# Altium project Logicboard_Rev1.PrjPcb (part 1 of 2)
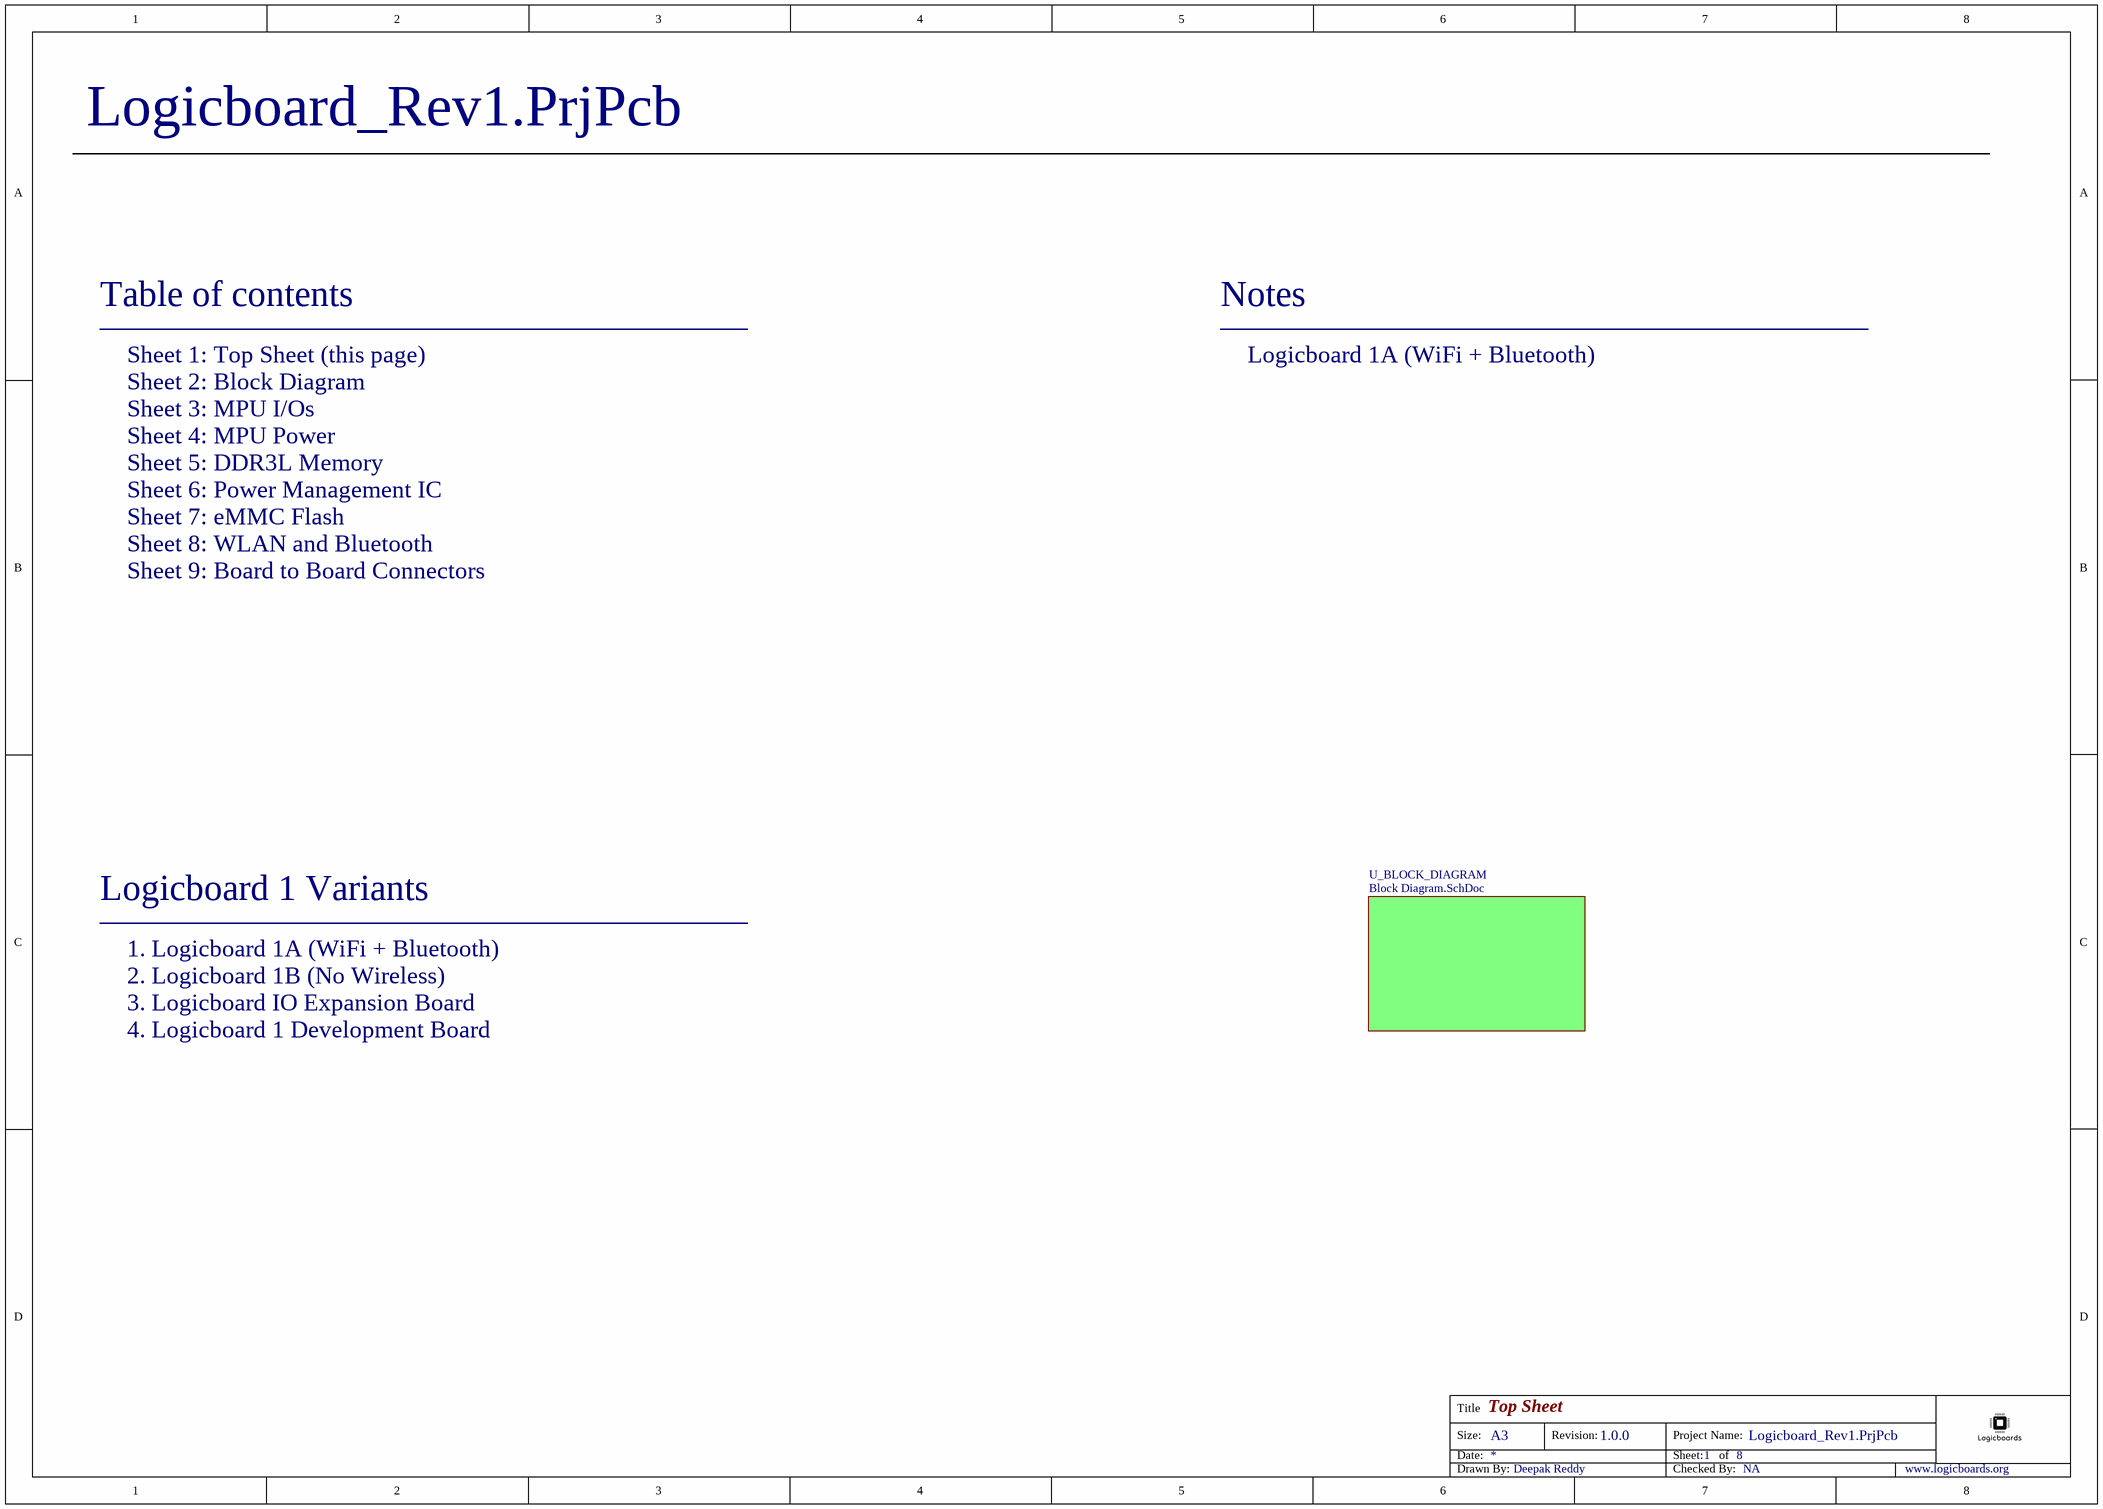
[diagram p0: Top Sheet.SchDoc]
9 sheets, 183 parts. Net scope: flat (ports and power ports of the same name join across sheets).
Board file: Logicboard PCB.PcbDoc
Sheets:
  Top Sheet.SchDoc
    U_BLOCK_DIAGRAM = Block Diagram.SchDoc
      U_MPU_POWER = MPU Power.SchDoc
      U_MPU_18X18 = MPU IOs.SchDoc
      U_DDR3L_MEMORY = DDR3L Memory.SchDoc
      U_POWER_MANAGEMENT_IC = Power Management IC.SchDoc
      U_eMMC_FLASH = eMMC FLASH.SchDoc
      U_WLAN_BLUETOOTH = WLAN and Bluetooth.SchDoc
      U_BOARD_TO_BOARD_CONNECTORS = Board to Board Connectors.SchDoc

## Sheet Top Sheet.SchDoc: Top Sheet
size A3; Date: 09-Sep-2021; CheckedBy: NA; Author: Deepak Reddy; CompanyName: www.logicboards.org; DrawnBy: Deepak Reddy; Revision: 1.0.0; SheetNumber: 1; SheetTotal: 8

### Sub-sheets
U_BLOCK_DIAGRAM = Block Diagram.SchDoc: no entries

### Notes on the sheet
- Table of contents
- Notes
- Sheet 1: Top Sheet (this page)
- Logicboard 1A (WiFi + Bluetooth)
- Sheet 2: Block Diagram
- Sheet 3: MPU I/Os
- Sheet 4: MPU Power
- Sheet 6: Power Management IC
- Sheet 5: DDR3L Memory
- Sheet 8: WLAN and Bluetooth
- Sheet 7: eMMC Flash
- Sheet 9: Board to Board Connectors
- Logicboard 1 Variants
- 1. Logicboard 1A (WiFi + Bluetooth)
- 2. Logicboard 1B (No Wireless)
- 3. Logicboard IO Expansion Board
- 4. Logicboard 1 Development Board
- Title
- Size:
- Date:
- A3
- Revision:
- Project Name:
- Sheet:
- of
- Drawn By:
- Checked By:
- www.logicboards.org

## Sheet Block Diagram.SchDoc: Block Diagram
size A3; CheckedBy: NA; DrawnBy: Deepak Reddy; Revision: 1.0.0; SheetNumber: 2; SheetTotal: 8
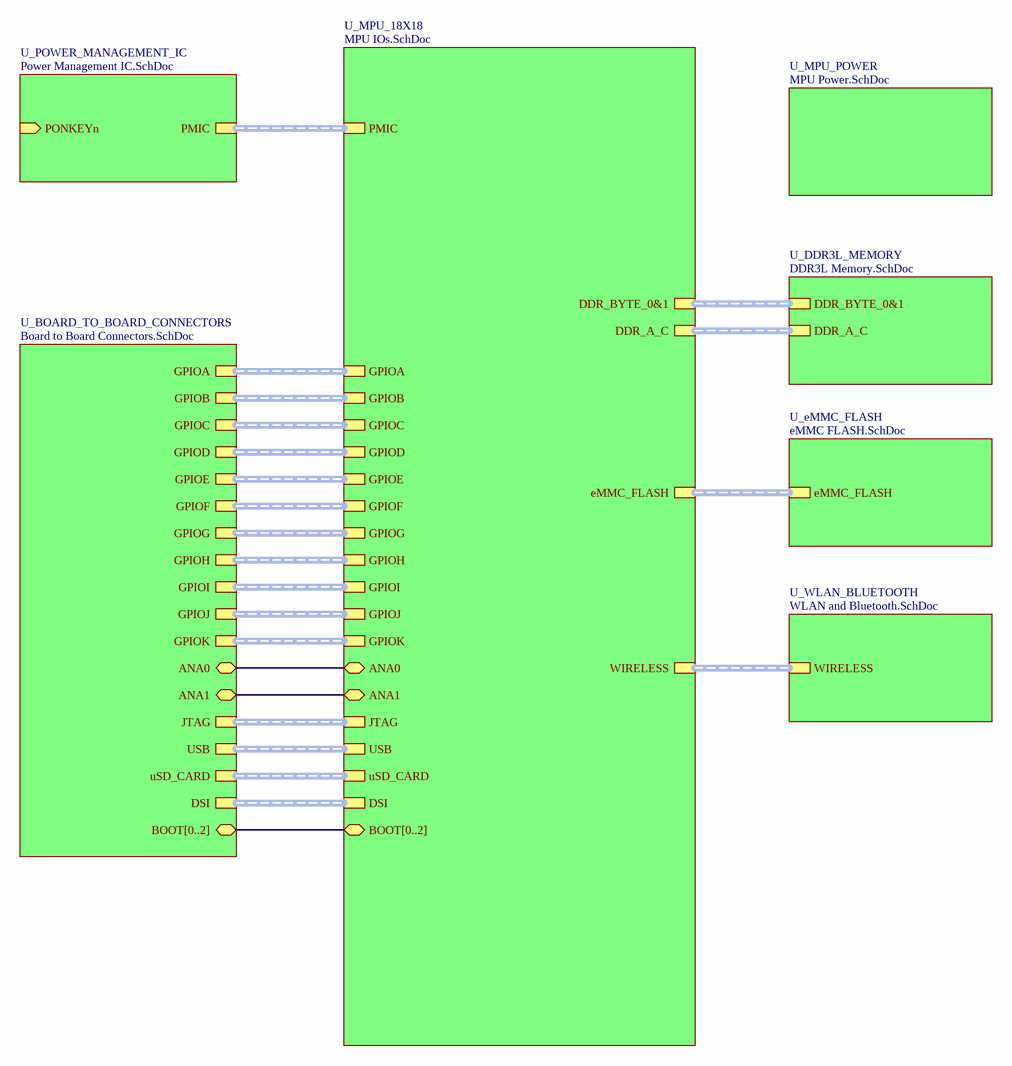
[diagram p1: Block Diagram.SchDoc]

### Sub-sheets
U_BOARD_TO_BOARD_CONNECTORS = Board to Board Connectors.SchDoc: GPIOA (harness GPIOA), GPIOC (harness GPIOC), GPIOB (harness GPIOB), GPIOD (harness GPIOD), ANA1 (bidir), GPIOF (harness GPIOF), GPIOI (harness GPIOI), JTAG (harness JTAG), USB (harness USB), DSI (harness DSI), GPIOK (harness GPIOK), GPIOG (harness GPIOG), GPIOH (harness GPIOH), BOOT[0..2] (bidir), ANA0 (bidir), GPIOE (harness GPIOE), uSD_CARD (harness uSD_CARD), GPIOJ (harness GPIOJ)
U_DDR3L_MEMORY = DDR3L Memory.SchDoc: DDR_BYTE_0&1 (harness DDR_BYTE_0&1), DDR_A_C (harness DDR_A_C)
U_eMMC_FLASH = eMMC FLASH.SchDoc: eMMC_FLASH (harness eMMC_FLASH)
U_MPU_18X18 = MPU IOs.SchDoc: GPIOD (harness GPIOD), ANA1 (bidir), GPIOF (harness GPIOF), DDR_BYTE_0&1 (harness DDR_BYTE_0&1), GPIOA (harness GPIOA), PMIC (harness PMIC), DDR_A_C (harness DDR_A_C), GPIOI (harness GPIOI), JTAG (harness JTAG), USB (harness USB), DSI (harness DSI), GPIOK (harness GPIOK), GPIOG (harness GPIOG), GPIOC (harness GPIOC), GPIOH (harness GPIOH), BOOT[0..2] (bidir), ANA0 (bidir), GPIOE (harness GPIOE), uSD_CARD (harness uSD_CARD), WIRELESS (harness WIRELESS), eMMC_FLASH (harness eMMC_FLASH), GPIOJ (harness GPIOJ), GPIOB (harness GPIOB)
U_MPU_POWER = MPU Power.SchDoc: no entries
U_POWER_MANAGEMENT_IC = Power Management IC.SchDoc: PMIC (harness PMIC), PONKEYn (in)
U_WLAN_BLUETOOTH = WLAN and Bluetooth.SchDoc: WIRELESS (harness WIRELESS)

### Nets
(unnamed): sheet U_MPU_18X18/ANA1, sheet U_BOARD_TO_BOARD_CONNECTORS/ANA1
(unnamed): sheet U_MPU_18X18/ANA0, sheet U_BOARD_TO_BOARD_CONNECTORS/ANA0

### Buses and harness runs
bus sheet U_BOARD_TO_BOARD_CONNECTORS/BOOT[0..2] = sheet U_MPU_18X18/BOOT[0..2]
harness sheet U_BOARD_TO_BOARD_CONNECTORS/DSI = sheet U_MPU_18X18/DSI
harness sheet U_BOARD_TO_BOARD_CONNECTORS/GPIOA = sheet U_MPU_18X18/GPIOA
harness sheet U_BOARD_TO_BOARD_CONNECTORS/GPIOB = sheet U_MPU_18X18/GPIOB
harness sheet U_BOARD_TO_BOARD_CONNECTORS/GPIOC = sheet U_MPU_18X18/GPIOC
harness sheet U_BOARD_TO_BOARD_CONNECTORS/GPIOD = sheet U_MPU_18X18/GPIOD
harness sheet U_BOARD_TO_BOARD_CONNECTORS/GPIOE = sheet U_MPU_18X18/GPIOE
harness sheet U_BOARD_TO_BOARD_CONNECTORS/GPIOF = sheet U_MPU_18X18/GPIOF
harness sheet U_BOARD_TO_BOARD_CONNECTORS/GPIOG = sheet U_MPU_18X18/GPIOG
harness sheet U_BOARD_TO_BOARD_CONNECTORS/GPIOH = sheet U_MPU_18X18/GPIOH
harness sheet U_BOARD_TO_BOARD_CONNECTORS/GPIOI = sheet U_MPU_18X18/GPIOI
harness sheet U_BOARD_TO_BOARD_CONNECTORS/GPIOJ = sheet U_MPU_18X18/GPIOJ
harness sheet U_BOARD_TO_BOARD_CONNECTORS/GPIOK = sheet U_MPU_18X18/GPIOK
harness sheet U_BOARD_TO_BOARD_CONNECTORS/JTAG = sheet U_MPU_18X18/JTAG
harness sheet U_BOARD_TO_BOARD_CONNECTORS/USB = sheet U_MPU_18X18/USB
harness sheet U_BOARD_TO_BOARD_CONNECTORS/uSD_CARD = sheet U_MPU_18X18/uSD_CARD
harness sheet U_DDR3L_MEMORY/DDR_A_C = sheet U_MPU_18X18/DDR_A_C
harness sheet U_DDR3L_MEMORY/DDR_BYTE_0&1 = sheet U_MPU_18X18/DDR_BYTE_0&1
harness sheet U_eMMC_FLASH/eMMC_FLASH = sheet U_MPU_18X18/eMMC_FLASH
harness sheet U_MPU_18X18/PMIC = sheet U_POWER_MANAGEMENT_IC/PMIC
harness sheet U_MPU_18X18/WIRELESS = sheet U_WLAN_BLUETOOTH/WIRELESS

### Notes on the sheet
- Title
- Size:
- Date:
- A3
- Revision:
- Project Name:
- Sheet:
- of
- Drawn By:
- Checked By:
- www.logicboards.org

## Sheet MPU Power.SchDoc
size A4
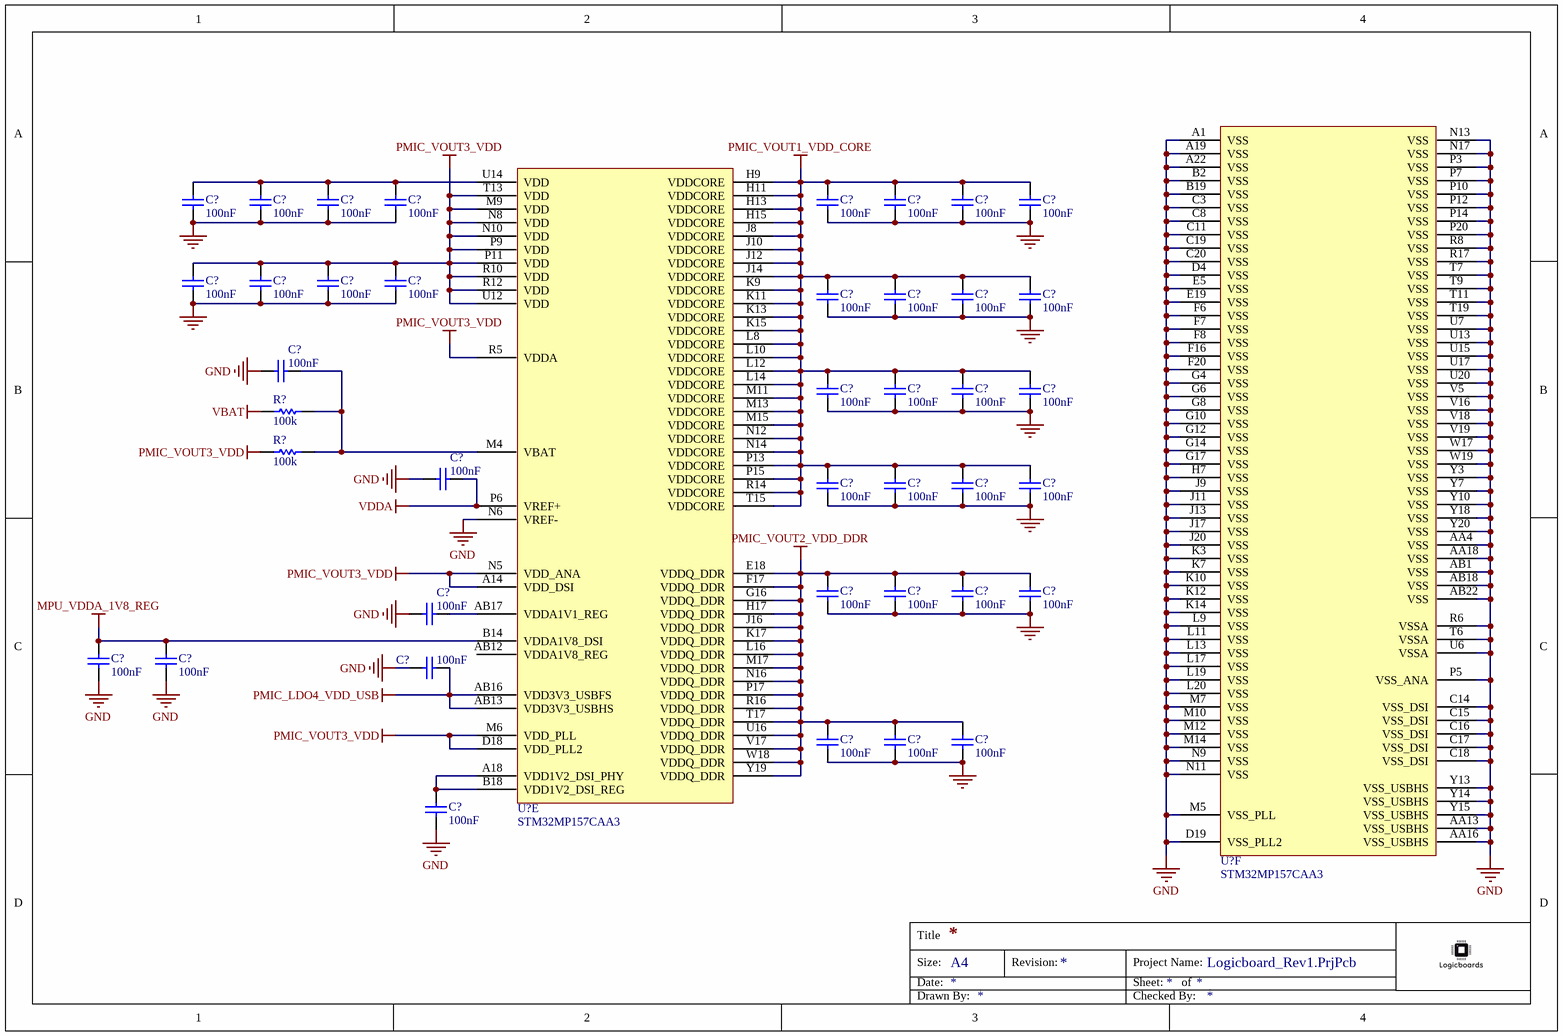
[diagram p2: MPU Power.SchDoc]

### Parts
(Parts that share a designator on the sheet are numbered #1, #2 ... from top to bottom, then left to right.)
C?#1  100nF
C?#2  100nF
C?#3  100nF
C?#4  100nF
C?#5  100nF
C?#6  100nF
C?#7  100nF
C?#8  100nF
C?#9  100nF
C?#10  100nF
C?#11  100nF
C?#12  100nF
C?#13  100nF
C?#14  100nF
C?#15  100nF
C?#16  100nF
C?#17  100nF
C?#18  100nF
C?#19  100nF
C?#20  100nF
C?#21  100nF
C?#22  100nF
C?#23  100nF
C?#24  100nF
C?#25  100nF
C?#26  100nF
C?#27  100nF
C?#28  100nF
C?#29  100nF
C?#30  100nF
C?#31  100nF
C?#32  100nF
C?#33  100nF
C?#34  100nF
C?#35  100nF
C?#36  100nF
C?#37  100nF
C?#38  100nF
R?#1  100k
R?#2  100k
U?#1  STM32MP157CAA3  (part E of 6)
U?#2  STM32MP157CAA3  (part F of 6)

### Nets
GND: C?#1.2 C?#2.2 C?#3.2 C?#4.2 C?#5.2 C?#6.2 C?#7.2 C?#8.2 C?#9.2 C?#10.2 C?#11.2 C?#12.2 C?#13.2 C?#14.2 C?#15.2 C?#16.2 C?#17.1 C?#18.2 C?#19.2 C?#20.2 C?#21.2 C?#22.1 C?#23.2 C?#24.2 C?#25.2 C?#26.2 C?#27.2 C?#28.2 C?#29.2 C?#30.2 C?#31.1 C?#32.2 C?#33.2 C?#34.1 C?#35.2 C?#36.2 C?#37.2 C?#38.2 U?#1.N6(VREF-) U?#2.A1(VSS) U?#2.A19(VSS) U?#2.A22(VSS) U?#2.AA4(VSS) U?#2.AA13(VSS_USBHS) U?#2.AA16(VSS_USBHS) U?#2.AA18(VSS) U?#2.AB1(VSS) U?#2.AB18(VSS) U?#2.AB22(VSS) U?#2.B2(VSS) U?#2.B19(VSS) U?#2.C3(VSS) U?#2.C8(VSS) U?#2.C11(VSS) U?#2.C14(VSS_DSI) U?#2.C15(VSS_DSI) U?#2.C16(VSS_DSI) U?#2.C17(VSS_DSI) U?#2.C18(VSS_DSI) U?#2.C19(VSS) U?#2.C20(VSS) U?#2.D4(VSS) U?#2.D19(VSS_PLL2) U?#2.E5(VSS) U?#2.E19(VSS) U?#2.F6(VSS) U?#2.F7(VSS) U?#2.F8(VSS) U?#2.F16(VSS) U?#2.F20(VSS) U?#2.G4(VSS) U?#2.G6(VSS) U?#2.G8(VSS) U?#2.G10(VSS) U?#2.G12(VSS) U?#2.G14(VSS) U?#2.G17(VSS) U?#2.H7(VSS) U?#2.J9(VSS) U?#2.J11(VSS) U?#2.J13(VSS) U?#2.J17(VSS) U?#2.J20(VSS) U?#2.K3(VSS) U?#2.K7(VSS) U?#2.K10(VSS) U?#2.K12(VSS) U?#2.K14(VSS) U?#2.L9(VSS) U?#2.L11(VSS) U?#2.L13(VSS) U?#2.L17(VSS) U?#2.L19(VSS) U?#2.L20(VSS) U?#2.M5(VSS_PLL) U?#2.M7(VSS) U?#2.M10(VSS) U?#2.M12(VSS) U?#2.M14(VSS) U?#2.N9(VSS) U?#2.N11(VSS) U?#2.N13(VSS) U?#2.N17(VSS) U?#2.P3(VSS) U?#2.P5(VSS_ANA) U?#2.P7(VSS) U?#2.P10(VSS) U?#2.P12(VSS) U?#2.P14(VSS) U?#2.P20(VSS) U?#2.R6(VSSA) U?#2.R8(VSS) U?#2.R17(VSS) U?#2.T6(VSSA) U?#2.T7(VSS) U?#2.T9(VSS) U?#2.T11(VSS) U?#2.T19(VSS) U?#2.U6(VSSA) U?#2.U7(VSS) U?#2.U13(VSS) U?#2.U15(VSS) U?#2.U17(VSS) U?#2.U20(VSS) U?#2.V5(VSS) U?#2.V16(VSS) U?#2.V18(VSS) U?#2.V19(VSS) U?#2.W17(VSS) U?#2.W19(VSS) U?#2.Y3(VSS) U?#2.Y7(VSS) U?#2.Y10(VSS) U?#2.Y13(VSS_USBHS) U?#2.Y14(VSS_USBHS) U?#2.Y15(VSS_USBHS) U?#2.Y18(VSS) U?#2.Y20(VSS)
MPU_VDDA_1V8_REG: C?#32.1 C?#33.1 U?#1.B14(VDDA1V8_DSI)
PMIC_LDO4_VDD_USB: C?#34.2 U?#1.AB13(VDD3V3_USBHS) U?#1.AB16(VDD3V3_USBFS)
PMIC_VOUT1_VDD_CORE: C?#5.1 C?#6.1 C?#7.1 C?#8.1 C?#13.1 C?#14.1 C?#15.1 C?#16.1 C?#18.1 C?#19.1 C?#20.1 C?#21.1 C?#23.1 C?#24.1 C?#25.1 C?#26.1 U?#1.H9(VDDCORE) U?#1.H11(VDDCORE) U?#1.H13(VDDCORE) U?#1.H15(VDDCORE) U?#1.J8(VDDCORE) U?#1.J10(VDDCORE) U?#1.J12(VDDCORE) U?#1.J14(VDDCORE) U?#1.K9(VDDCORE) U?#1.K11(VDDCORE) U?#1.K13(VDDCORE) U?#1.K15(VDDCORE) U?#1.L8(VDDCORE) U?#1.L10(VDDCORE) U?#1.L12(VDDCORE) U?#1.L14(VDDCORE) U?#1.M11(VDDCORE) U?#1.M13(VDDCORE) U?#1.M15(VDDCORE) U?#1.N12(VDDCORE) U?#1.N14(VDDCORE) U?#1.P13(VDDCORE) U?#1.P15(VDDCORE) U?#1.R14(VDDCORE) U?#1.T15(VDDCORE)
PMIC_VOUT2_VDD_DDR: C?#27.1 C?#28.1 C?#29.1 C?#30.1 C?#35.1 C?#36.1 C?#37.1 U?#1.E18(VDDQ_DDR) U?#1.F17(VDDQ_DDR) U?#1.G16(VDDQ_DDR) U?#1.H17(VDDQ_DDR) U?#1.J16(VDDQ_DDR) U?#1.K17(VDDQ_DDR) U?#1.L16(VDDQ_DDR) U?#1.M17(VDDQ_DDR) U?#1.N16(VDDQ_DDR) U?#1.P17(VDDQ_DDR) U?#1.R16(VDDQ_DDR) U?#1.T17(VDDQ_DDR) U?#1.U16(VDDQ_DDR) U?#1.V17(VDDQ_DDR) U?#1.W18(VDDQ_DDR) U?#1.Y19(VDDQ_DDR)
PMIC_VOUT3_VDD: C?#9.1 C?#10.1 C?#11.1 C?#12.1 R?#2.1 U?#1.A14(VDD_DSI) U?#1.D18(VDD_PLL2) U?#1.M6(VDD_PLL) U?#1.M9(VDD) U?#1.N5(VDD_ANA) U?#1.N8(VDD) U?#1.N10(VDD) U?#1.P9(VDD) U?#1.P11(VDD) U?#1.R5(VDDA) U?#1.R10(VDD) U?#1.R12(VDD) U?#1.T13(VDD) U?#1.U12(VDD)
VBAT: R?#1.1
VDDA: C?#22.2 U?#1.P6(VREF+)
NetC?#1_1: C?#1.1 C?#2.1 C?#3.1 C?#4.1 U?#1.U14(VDD)
NetC?#17_2: C?#17.2 R?#1.2 R?#2.2 U?#1.M4(VBAT)
NetC?#31_2: C?#31.2 U?#1.AB17(VDDA1V1_REG)
NetC?#38_1: C?#38.1 U?#1.A18(VDD1V2_DSI_PHY) U?#1.B18(VDD1V2_DSI_REG)

Not connected (* = marked no-connect by the designer): U?#1 AB12(VDDA1V8_REG)

### Notes on the sheet
- Title
- Size:
- Date:
- A4
- Revision:
- Sheet:
- Project Name:
- of
- Drawn By:
- Checked By:

### Library data of the parts
C?#1-C?#38 = CAP_SMD: Capacitor MLCC; Tolerance: 10%; Dielectric: X5R; Voltage Rating: 6.3V; Supplier 1: Mouser; Manufacturer 1: *; Manufacturer Part Number 1: *; RoHS: Yes; Mount: Surface Mount; Package: *; Capacitance: *; Length: *; Lead Free: Lead Free; Supplier Part Number 1: *; Supplier 2: Digikey; Supplier Part Number 2: *; Value: 100nF
R?#1 R?#2 = RES_SMD: General Purpose Chip Resistor Thick Film; Supplier 1: Mouser; RoHS: Yes; Category: Resistors; RoHS Compliant: Yes; Resistance: *; Supplier 2: Digikey; Supplier Part Number 2: *; Package: *; Value: 100k
U?#1 U?#2 = STM32MP157CAA3: IC MPU with Arm Dual Cortex-A7 650 MHz, Arm Cortex-M4; Manufacturer 1: STMicroelectronics; Supplier 1: Mouser; RoHS: Yes; Category: Microprocessors; Supplier Part Number 1: 511-STM32MP157CAA3; Supplier 2: Digi-Key; Supplier Part Number 2: STM32MP157CAA3-ND; Manufacturer Part Number 1: STM32MP157CAA3; Datasheet: https://www.st.com/resource/en/datasheet/stm32mp157c.pdf

## Sheet MPU IOs.SchDoc: MPU I/Os
size A3; CheckedBy: NA; DrawnBy: Deepak Reddy; Revision: 1.0.0; SheetNumber: 3; SheetTotal: 8
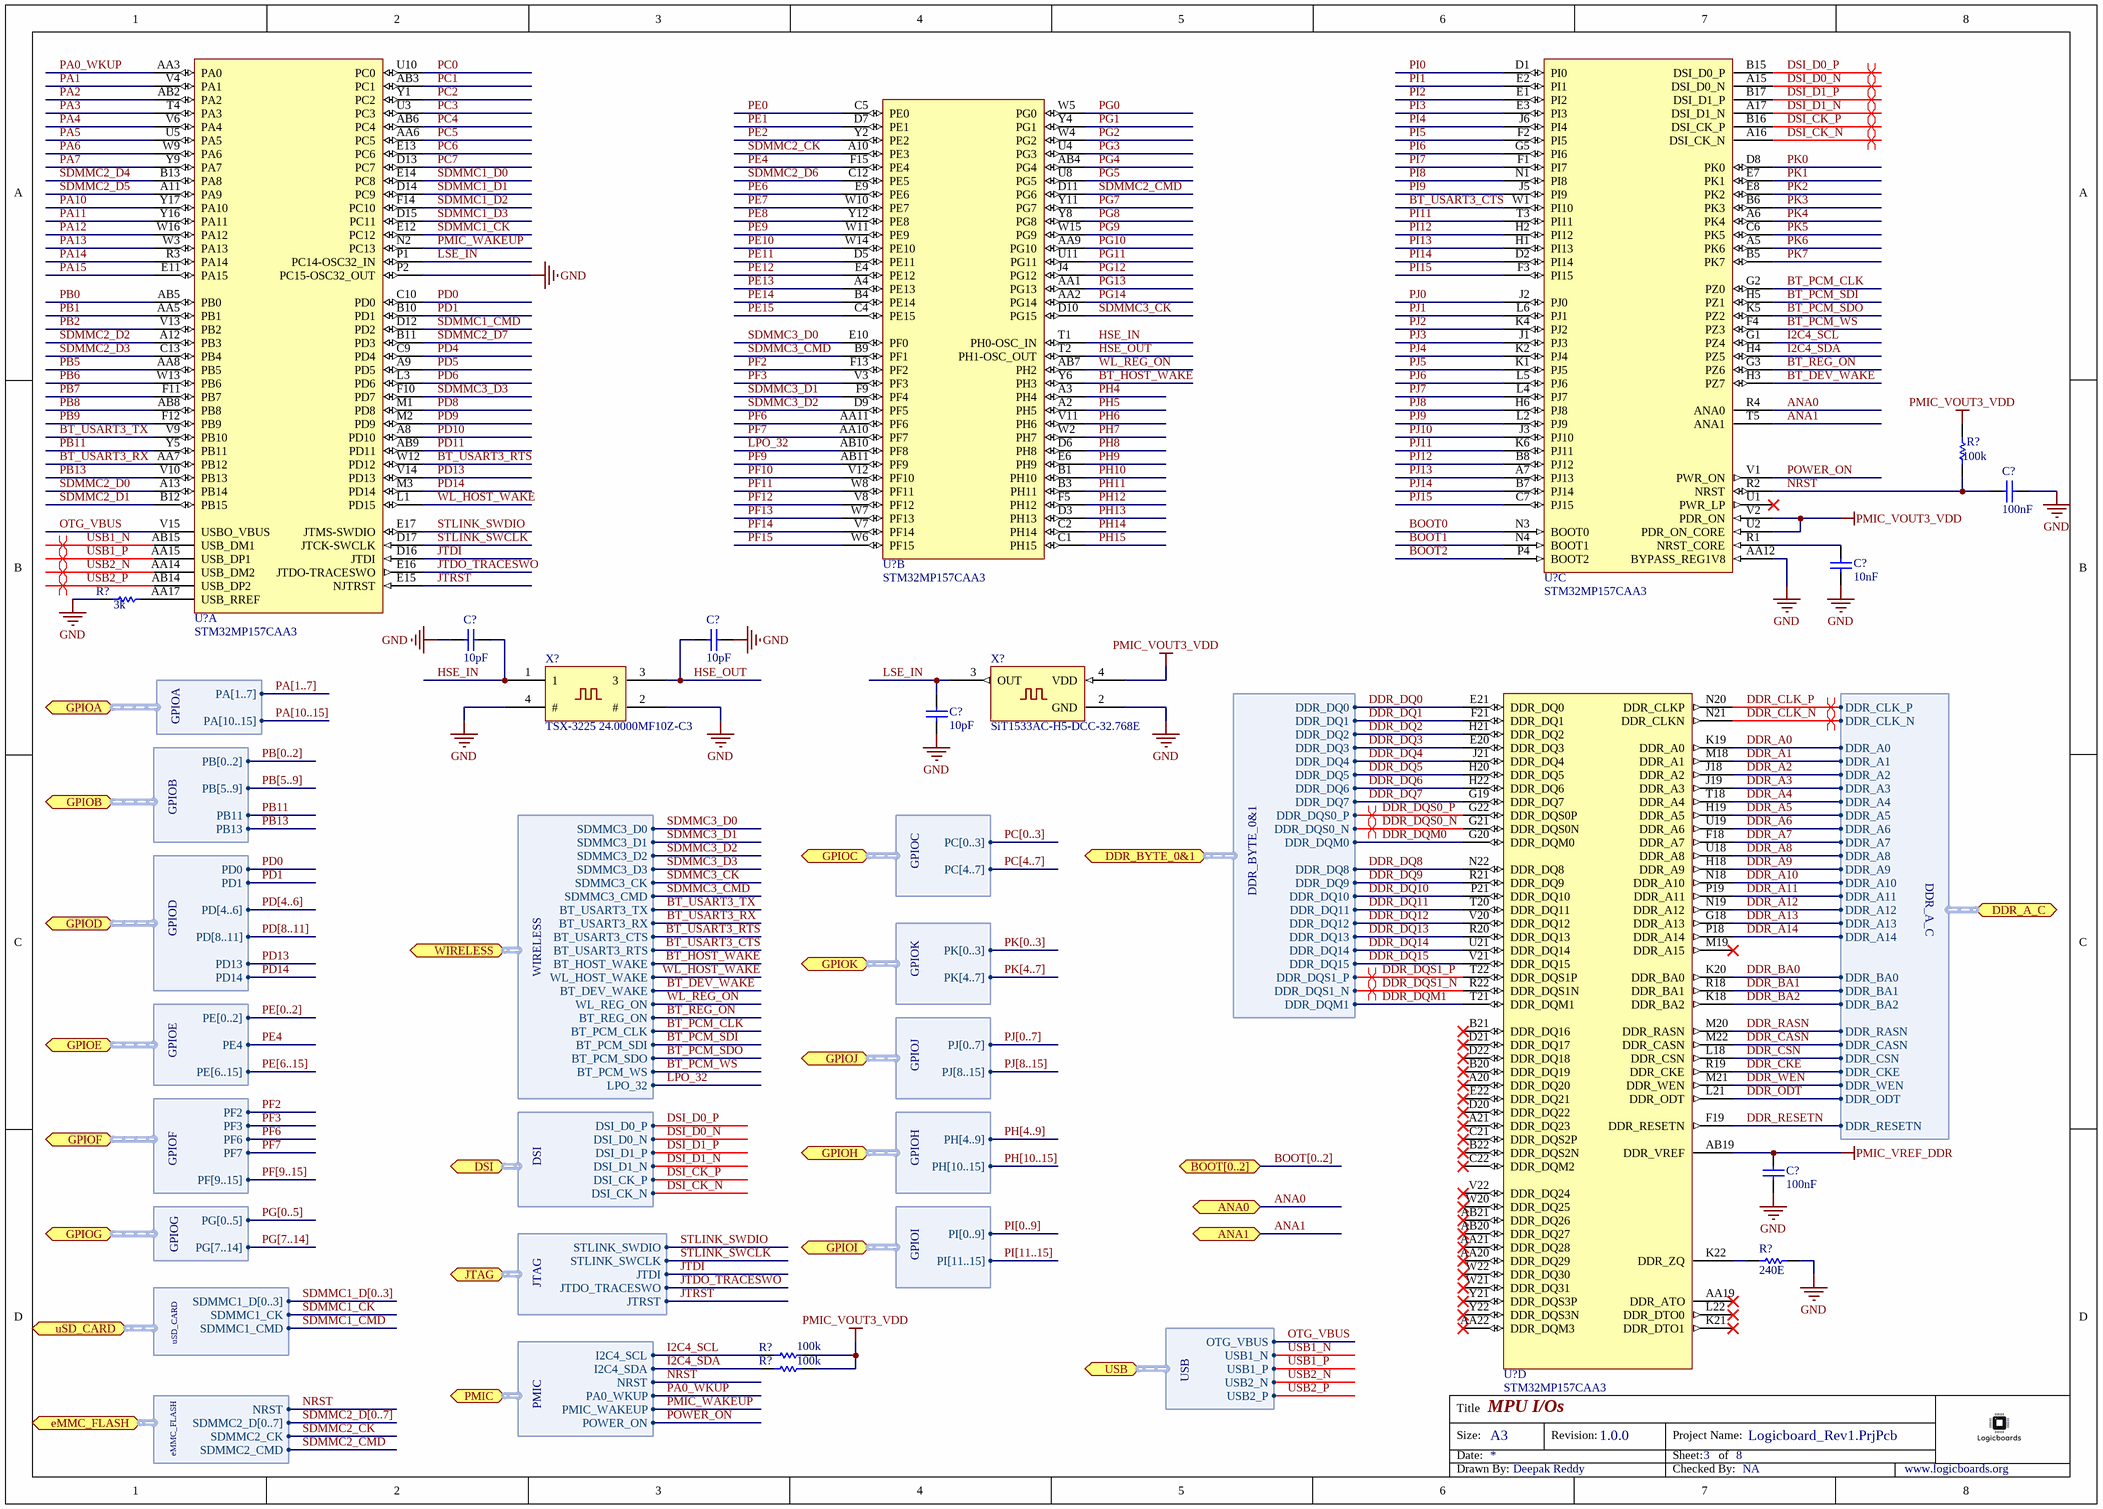
[diagram p3: MPU IOs.SchDoc]

### Parts
(Parts that share a designator on the sheet are numbered #1, #2 ... from top to bottom, then left to right.)
C?#39  100nF
C?#40  10nF
C?#41  10pF
C?#42  10pF
C?#43  10pF
C?#44  100nF
R?#3  100k
R?#4  3k
R?#5  240E
R?#6  100k
R?#7  100k
U?#3  STM32MP157CAA3  (part C of 6)
U?#4  STM32MP157CAA3  (part B of 6)
U?#5  STM32MP157CAA3  (part A of 6)
U?#6  STM32MP157CAA3  (part D of 6)
X?#1  TSX-3225 24.0000MF10Z-C3
X?#2  SiT1533AC-H5-DCC-32.768E

### Ports
ANA0 (bidir), ANA1 (bidir), BOOT[0..2] (bidir), DDR_A_C (bidir, harness DDR_A_C), DDR_BYTE_0&1 (bidir, harness DDR_BYTE_0&1), DSI (bidir, harness DSI), eMMC_FLASH (bidir, harness eMMC_FLASH), GPIOA (bidir, harness GPIOA), GPIOB (bidir, harness GPIOB), GPIOC (bidir, harness GPIOC), GPIOD (bidir, harness GPIOD), GPIOE (bidir, harness GPIOE), GPIOF (bidir, harness GPIOF), GPIOG (bidir, harness GPIOG), GPIOH (bidir, harness GPIOH), GPIOI (bidir, harness GPIOI), GPIOJ (bidir, harness GPIOJ), GPIOK (bidir, harness GPIOK), JTAG (bidir, harness JTAG), PMIC (bidir, harness PMIC), USB (bidir, harness USB), uSD_CARD (bidir, harness uSD_CARD), WIRELESS (bidir, harness WIRELESS)

### Harnesses
DDR_BYTE_0&1: DDR_DQ0, DDR_DQ1, DDR_DQ2, DDR_DQ3, DDR_DQ4, DDR_DQ5, DDR_DQ6, DDR_DQ7, DDR_DQS0_P, DDR_DQS0_N, DDR_DQM0, DDR_DQ8, DDR_DQ9, DDR_DQ10, DDR_DQ11, DDR_DQ12, DDR_DQ13, DDR_DQ14, DDR_DQ15, DDR_DQS1_P, DDR_DQS1_N, DDR_DQM1
DDR_A_C: DDR_CLK_P, DDR_CLK_N, DDR_A0, DDR_A1, DDR_A2, DDR_A3, DDR_A4, DDR_A5, DDR_A6, DDR_A7, DDR_A8, DDR_A9, DDR_A10, DDR_A11, DDR_A12, DDR_A13, DDR_A14, DDR_BA0, DDR_BA1, DDR_BA2, DDR_RASN, DDR_CASN, DDR_CSN, DDR_CKE, DDR_WEN, DDR_ODT, DDR_RESETN
GPIOF: PF2, PF3, PF6, PF7, PF[9..15]
uSD_CARD: SDMMC1_CK, SDMMC1_CMD, SDMMC1_D[0..3]
eMMC_FLASH: SDMMC2_D[0..7], SDMMC2_CK, SDMMC2_CMD, NRST
WIRELESS: SDMMC3_D0, SDMMC3_D1, SDMMC3_D2, SDMMC3_D3, SDMMC3_CK, SDMMC3_CMD, BT_USART3_TX, BT_USART3_RX, BT_USART3_CTS, BT_USART3_RTS, BT_HOST_WAKE, WL_HOST_WAKE, BT_DEV_WAKE, WL_REG_ON, BT_REG_ON, BT_PCM_CLK, BT_PCM_SDI, BT_PCM_SDO, BT_PCM_WS, LPO_32
GPIOA: PA[1..7], PA[10..15]
GPIOB: PB[0..2], PB[5..9], PB11, PB13
GPIOD: PD0, PD1, PD[4..6], PD[8..11], PD13, PD14
GPIOE: PE[0..2], PE4, PE[6..15]
GPIOG: PG[0..5], PG[7..14]
DSI: DSI_D0_P, DSI_D0_N, DSI_D1_P, DSI_D1_N, DSI_CK_P, DSI_CK_N
JTAG: STLINK_SWDIO, STLINK_SWCLK, JTDI, JTDO_TRACESWO, JTRST
PMIC: I2C4_SCL, I2C4_SDA, NRST, PA0_WKUP, PMIC_WAKEUP, POWER_ON
USB: OTG_VBUS, USB1_N, USB1_P, USB2_N, USB2_P
GPIOK: PK[0..3], PK[4..7]
GPIOJ: PJ[0..7], PJ[8..15]
GPIOH: PH[4..9], PH[10..15]
GPIOI: PI[0..9], PI[11..15]
GPIOC: PC[0..3], PC[4..7]

### Nets
GND: C?#39.1 C?#40.2 C?#41.1 C?#42.2 C?#43.2 C?#44.2 R?#4.2 R?#5.2 U?#3.AA12(BYPASS_REG1V8) U?#5.P2(PC15-OSC32_OUT) X?#1.2(#) X?#1.4(#) X?#2.2(GND)
PMIC_VOUT3_VDD: R?#3.2 R?#6.2 R?#7.2 U?#3.U2(PDR_ON_CORE) U?#3.V2(PDR_ON) X?#2.4(VDD)
PMIC_VREF_DDR: C?#44.1 U?#6.AB19(DDR_VREF)
ANA0: U?#3.R4(ANA0) ; port ANA0
ANA1: U?#3.T5(ANA1) ; port ANA1
BOOT0: U?#3.N3(BOOT0)
BOOT1: U?#3.N4(BOOT1)
BOOT2: U?#3.P4(BOOT2)
BT_DEV_WAKE: U?#3.H3(PZ7) ; port WIRELESS.BT_DEV_WAKE
BT_HOST_WAKE: U?#4.Y6(PH3) ; port WIRELESS.BT_HOST_WAKE
BT_PCM_CLK: U?#3.G2(PZ0) ; port WIRELESS.BT_PCM_CLK
BT_PCM_SDI: U?#3.H5(PZ1) ; port WIRELESS.BT_PCM_SDI
BT_PCM_SDO: U?#3.K5(PZ2) ; port WIRELESS.BT_PCM_SDO
BT_PCM_WS: U?#3.F4(PZ3) ; port WIRELESS.BT_PCM_WS
BT_REG_ON: U?#3.G3(PZ6) ; port WIRELESS.BT_REG_ON
BT_USART3_CTS: U?#3.W1(PI10) ; port WIRELESS.BT_USART3_RTS
BT_USART3_RTS: U?#5.W12(PD12) ; port WIRELESS.BT_USART3_CTS  [project net BT_USART3_CTS]
BT_USART3_RX: U?#5.AA7(PB12) ; port WIRELESS.BT_USART3_RX
BT_USART3_TX: U?#5.V9(PB10) ; port WIRELESS.BT_USART3_TX
DDR_A0: U?#6.K19(DDR_A0) ; port DDR_A_C.DDR_A0
DDR_A1: U?#6.M18(DDR_A1) ; port DDR_A_C.DDR_A1
DDR_A2: U?#6.J18(DDR_A2) ; port DDR_A_C.DDR_A2
DDR_A3: U?#6.J19(DDR_A3) ; port DDR_A_C.DDR_A3
DDR_A4: U?#6.T18(DDR_A4) ; port DDR_A_C.DDR_A4
DDR_A5: U?#6.H19(DDR_A5) ; port DDR_A_C.DDR_A5
DDR_A6: U?#6.U19(DDR_A6) ; port DDR_A_C.DDR_A6
DDR_A7: U?#6.F18(DDR_A7) ; port DDR_A_C.DDR_A7
DDR_A8: U?#6.U18(DDR_A8) ; port DDR_A_C.DDR_A8
DDR_A9: U?#6.H18(DDR_A9) ; port DDR_A_C.DDR_A9
DDR_A10: U?#6.N18(DDR_A10) ; port DDR_A_C.DDR_A10
DDR_A11: U?#6.P19(DDR_A11) ; port DDR_A_C.DDR_A11
DDR_A12: U?#6.N19(DDR_A12) ; port DDR_A_C.DDR_A12
DDR_A13: U?#6.G18(DDR_A13) ; port DDR_A_C.DDR_A13
DDR_A14: U?#6.P18(DDR_A14) ; port DDR_A_C.DDR_A14
DDR_BA0: U?#6.K20(DDR_BA0) ; port DDR_A_C.DDR_BA0
DDR_BA1: U?#6.R18(DDR_BA1) ; port DDR_A_C.DDR_BA1
DDR_BA2: U?#6.K18(DDR_BA2) ; port DDR_A_C.DDR_BA2
DDR_CASN: U?#6.M22(DDR_CASN) ; port DDR_A_C.DDR_CASN
DDR_CKE: U?#6.R19(DDR_CKE) ; port DDR_A_C.DDR_CKE
DDR_CLK_N: U?#6.N21(DDR_CLKN) ; port DDR_A_C.DDR_CLK_N
DDR_CLK_P: U?#6.N20(DDR_CLKP) ; port DDR_A_C.DDR_CLK_P
DDR_CSN: U?#6.L18(DDR_CSN) ; port DDR_A_C.DDR_CSN
DDR_DQ0: U?#6.E21(DDR_DQ0) ; port DDR_BYTE_0&1.DDR_DQ0
DDR_DQ1: U?#6.F21(DDR_DQ1) ; port DDR_BYTE_0&1.DDR_DQ1
DDR_DQ2: U?#6.H21(DDR_DQ2) ; port DDR_BYTE_0&1.DDR_DQ2
DDR_DQ3: U?#6.E20(DDR_DQ3) ; port DDR_BYTE_0&1.DDR_DQ3
DDR_DQ4: U?#6.J21(DDR_DQ4) ; port DDR_BYTE_0&1.DDR_DQ4
DDR_DQ5: U?#6.H20(DDR_DQ5) ; port DDR_BYTE_0&1.DDR_DQ5
DDR_DQ6: U?#6.H22(DDR_DQ6) ; port DDR_BYTE_0&1.DDR_DQ6
DDR_DQ7: U?#6.G19(DDR_DQ7) ; port DDR_BYTE_0&1.DDR_DQ7
DDR_DQ8: U?#6.N22(DDR_DQ8) ; port DDR_BYTE_0&1.DDR_DQ8
DDR_DQ9: U?#6.R21(DDR_DQ9) ; port DDR_BYTE_0&1.DDR_DQ9
DDR_DQ10: U?#6.P21(DDR_DQ10) ; port DDR_BYTE_0&1.DDR_DQ10
DDR_DQ11: U?#6.T20(DDR_DQ11) ; port DDR_BYTE_0&1.DDR_DQ11
DDR_DQ12: U?#6.V20(DDR_DQ12) ; port DDR_BYTE_0&1.DDR_DQ12
DDR_DQ13: U?#6.R20(DDR_DQ13) ; port DDR_BYTE_0&1.DDR_DQ13
DDR_DQ14: U?#6.U21(DDR_DQ14) ; port DDR_BYTE_0&1.DDR_DQ14
DDR_DQ15: U?#6.V21(DDR_DQ15) ; port DDR_BYTE_0&1.DDR_DQ15
DDR_DQM0: U?#6.G20(DDR_DQM0) ; port DDR_BYTE_0&1.DDR_DQM0
DDR_DQM1: U?#6.T21(DDR_DQM1) ; port DDR_BYTE_0&1.DDR_DQM1
DDR_DQS0_N: U?#6.G21(DDR_DQS0N) ; port DDR_BYTE_0&1.DDR_DQS0_N
DDR_DQS0_P: U?#6.G22(DDR_DQS0P) ; port DDR_BYTE_0&1.DDR_DQS0_P
DDR_DQS1_N: U?#6.R22(DDR_DQS1N) ; port DDR_BYTE_0&1.DDR_DQS1_N
DDR_DQS1_P: U?#6.T22(DDR_DQS1P) ; port DDR_BYTE_0&1.DDR_DQS1_P
DDR_ODT: U?#6.L21(DDR_ODT) ; port DDR_A_C.DDR_ODT
DDR_RASN: U?#6.M20(DDR_RASN) ; port DDR_A_C.DDR_RASN
DDR_RESETN: U?#6.F19(DDR_RESETN) ; port DDR_A_C.DDR_RESETN
DDR_WEN: U?#6.M21(DDR_WEN) ; port DDR_A_C.DDR_WEN
DSI_CK_N: U?#3.A16(DSI_CK_N) ; port DSI.DSI_CK_N
DSI_CK_P: U?#3.B16(DSI_CK_P) ; port DSI.DSI_CK_P
DSI_D0_N: U?#3.A15(DSI_D0_N) ; port DSI.DSI_D0_N
DSI_D0_P: U?#3.B15(DSI_D0_P) ; port DSI.DSI_D0_P
DSI_D1_N: U?#3.A17(DSI_D1_N) ; port DSI.DSI_D1_N
DSI_D1_P: U?#3.B17(DSI_D1_P) ; port DSI.DSI_D1_P
HSE_IN: C?#41.2 U?#4.T1(PH0-OSC_IN) X?#1.1
HSE_OUT: C?#42.1 U?#4.T2(PH1-OSC_OUT) X?#1.3
I2C4_SCL: R?#6.1 U?#3.G1(PZ4) ; port PMIC.I2C4_SCL
I2C4_SDA: R?#7.1 U?#3.H4(PZ5) ; port PMIC.I2C4_SDA
JTDI: U?#5.D16(JTDI) ; port JTAG.JTDI
JTDO_TRACESWO: U?#5.E16(JTDO-TRACESWO) ; port JTAG.JTDO_TRACESWO
JTRST: U?#5.E15(NJTRST) ; port JTAG.JTRST
LPO_32: U?#4.AB10(PF8) ; port WIRELESS.LPO_32
LSE_IN: C?#43.1 U?#5.P1(PC14-OSC32_IN) X?#2.3(OUT)
NRST: C?#39.2 R?#3.1 U?#3.R2(NRST) ; port eMMC_FLASH.NRST, port PMIC.NRST
OTG_VBUS: U?#5.V15(USBO_VBUS) ; port USB.OTG_VBUS
PA0_WKUP: U?#5.AA3(PA0) ; port PMIC.PA0_WKUP
PA1: U?#5.V4(PA1)
PA2: U?#5.AB2(PA2)
PA3: U?#5.T4(PA3)
PA4: U?#5.V6(PA4)
PA5: U?#5.U5(PA5)
PA6: U?#5.W9(PA6)
PA7: U?#5.Y9(PA7)
PA10: U?#5.Y17(PA10)
PA11: U?#5.Y16(PA11)
PA12: U?#5.W16(PA12)
PA13: U?#5.W3(PA13)
PA14: U?#5.R3(PA14)
PA15: U?#5.E11(PA15)
PB0: U?#5.AB5(PB0)
PB1: U?#5.AA5(PB1)
PB2: U?#5.V13(PB2)
PB5: U?#5.AA8(PB5)
PB6: U?#5.W13(PB6)
PB7: U?#5.F11(PB7)
PB8: U?#5.AB8(PB8)
PB9: U?#5.F12(PB9)
PB11: U?#5.Y5(PB11) ; port GPIOB.PB11
PB13: U?#5.V10(PB13) ; port GPIOB.PB13
PC0: U?#5.U10(PC0)
PC1: U?#5.AB3(PC1)
PC2: U?#5.Y1(PC2)
PC3: U?#5.U3(PC3)
PC4: U?#5.AB6(PC4)
PC5: U?#5.AA6(PC5)
PC6: U?#5.E13(PC6)
PC7: U?#5.D13(PC7)
PD0: U?#5.C10(PD0) ; port GPIOD.PD0
PD1: U?#5.B10(PD1) ; port GPIOD.PD1
PD4: U?#5.C9(PD4)
PD5: U?#5.A9(PD5)
PD6: U?#5.L3(PD6)
PD8: U?#5.M1(PD8)
PD9: U?#5.M2(PD9)
PD10: U?#5.A8(PD10)
PD11: U?#5.AB9(PD11)
PD13: U?#5.V14(PD13) ; port GPIOD.PD13
PD14: U?#5.M3(PD14) ; port GPIOD.PD14
PE0: U?#4.C5(PE0)
PE1: U?#4.D7(PE1)
PE2: U?#4.Y2(PE2)
PE4: U?#4.F15(PE4) ; port GPIOE.PE4
PE6: U?#4.E9(PE6)
PE7: U?#4.W10(PE7)
PE8: U?#4.Y12(PE8)
PE9: U?#4.W11(PE9)
PE10: U?#4.W14(PE10)
PE11: U?#4.D5(PE11)
PE12: U?#4.E4(PE12)
PE13: U?#4.A4(PE13)
PE14: U?#4.B4(PE14)
PE15: U?#4.C4(PE15)
PF2: U?#4.F13(PF2) ; port GPIOF.PF2
PF3: U?#4.V3(PF3) ; port GPIOF.PF3
PF6: U?#4.AA11(PF6) ; port GPIOF.PF6
PF7: U?#4.AA10(PF7) ; port GPIOF.PF7
PF9: U?#4.AB11(PF9)
PF10: U?#4.V12(PF10)
PF11: U?#4.W8(PF11)
PF12: U?#4.V8(PF12)
PF13: U?#4.W7(PF13)
PF14: U?#4.V7(PF14)
PF15: U?#4.W6(PF15)
PG0: U?#4.W5(PG0)
PG1: U?#4.Y4(PG1)
PG2: U?#4.W4(PG2)
PG3: U?#4.U4(PG3)
PG4: U?#4.AB4(PG4)
PG5: U?#4.U8(PG5)
PG7: U?#4.Y11(PG7)
PG8: U?#4.Y8(PG8)
PG9: U?#4.W15(PG9)
PG10: U?#4.AA9(PG10)
PG11: U?#4.U11(PG11)
PG12: U?#4.J4(PG12)
PG13: U?#4.AA1(PG13)
PG14: U?#4.AA2(PG14)
PH4: U?#4.A3(PH4)
PH5: U?#4.A2(PH5)
PH6: U?#4.V11(PH6)
PH7: U?#4.W2(PH7)
PH8: U?#4.D6(PH8)
PH9: U?#4.E6(PH9)
PH10: U?#4.B1(PH10)
PH11: U?#4.B3(PH11)
PH12: U?#4.F5(PH12)
PH13: U?#4.D3(PH13)
PH14: U?#4.C2(PH14)
PH15: U?#4.C1(PH15)
PI0: U?#3.D1(PI0)
PI1: U?#3.E2(PI1)
PI2: U?#3.E1(PI2)
PI3: U?#3.E3(PI3)
PI4: U?#3.J6(PI4)
PI5: U?#3.F2(PI5)
PI6: U?#3.G5(PI6)
PI7: U?#3.F1(PI7)
PI8: U?#3.N1(PI8)
PI9: U?#3.J5(PI9)
PI11: U?#3.T3(PI11)
PI12: U?#3.H2(PI12)
PI13: U?#3.H1(PI13)
PI14: U?#3.D2(PI14)
PI15: U?#3.F3(PI15)
PJ0: U?#3.J2(PJ0)
PJ1: U?#3.L6(PJ1)
PJ2: U?#3.K4(PJ2)
PJ3: U?#3.J1(PJ3)
PJ4: U?#3.K2(PJ4)
PJ5: U?#3.K1(PJ5)
PJ6: U?#3.L5(PJ6)
PJ7: U?#3.L4(PJ7)
PJ8: U?#3.H6(PJ8)
PJ9: U?#3.L2(PJ9)
PJ10: U?#3.J3(PJ10)
PJ11: U?#3.K6(PJ11)
PJ12: U?#3.B8(PJ12)
PJ13: U?#3.A7(PJ13)
PJ14: U?#3.B7(PJ14)
PJ15: U?#3.C7(PJ15)
PK0: U?#3.D8(PK0)
PK1: U?#3.E7(PK1)
PK2: U?#3.E8(PK2)
PK3: U?#3.B6(PK3)
PK4: U?#3.A6(PK4)
PK5: U?#3.C6(PK5)
PK6: U?#3.A5(PK6)
PK7: U?#3.B5(PK7)
PMIC_WAKEUP: U?#5.N2(PC13) ; port PMIC.PMIC_WAKEUP
POWER_ON: U?#3.V1(PWR_ON) ; port PMIC.POWER_ON
SDMMC1_CK: U?#5.E12(PC12) ; port uSD_CARD.SDMMC1_CK
SDMMC1_CMD: U?#5.D12(PD2) ; port uSD_CARD.SDMMC1_CMD
SDMMC1_D0: U?#5.E14(PC8)
SDMMC1_D1: U?#5.D14(PC9)
SDMMC1_D2: U?#5.F14(PC10)
SDMMC1_D3: U?#5.D15(PC11)
SDMMC2_CK: U?#4.A10(PE3) ; port eMMC_FLASH.SDMMC2_CK
SDMMC2_CMD: U?#4.D11(PG6) ; port eMMC_FLASH.SDMMC2_CMD
SDMMC2_D0: U?#5.A13(PB14)
SDMMC2_D1: U?#5.B12(PB15)
SDMMC2_D2: U?#5.A12(PB3)
SDMMC2_D3: U?#5.C13(PB4)
SDMMC2_D4: U?#5.B13(PA8)
SDMMC2_D5: U?#5.A11(PA9)
SDMMC2_D6: U?#4.C12(PE5)
SDMMC2_D7: U?#5.B11(PD3)
SDMMC3_CK: U?#4.D10(PG15) ; port WIRELESS.SDMMC3_CK
SDMMC3_CMD: U?#4.B9(PF1) ; port WIRELESS.SDMMC3_CMD
SDMMC3_D0: U?#4.E10(PF0) ; port WIRELESS.SDMMC3_D0
SDMMC3_D1: U?#4.F9(PF4) ; port WIRELESS.SDMMC3_D1
SDMMC3_D2: U?#4.D9(PF5) ; port WIRELESS.SDMMC3_D2
SDMMC3_D3: U?#5.F10(PD7) ; port WIRELESS.SDMMC3_D3
STLINK_SWCLK: U?#5.D17(JTCK-SWCLK) ; port JTAG.STLINK_SWCLK
STLINK_SWDIO: U?#5.E17(JTMS-SWDIO) ; port JTAG.STLINK_SWDIO
USB1_N: U?#5.AB15(USB_DM1) ; port USB.USB1_N
USB1_P: U?#5.AA15(USB_DP1) ; port USB.USB1_P
USB2_N: U?#5.AA14(USB_DM2) ; port USB.USB2_N
USB2_P: U?#5.AB14(USB_DP2) ; port USB.USB2_P
WL_HOST_WAKE: U?#5.L1(PD15) ; port WIRELESS.WL_HOST_WAKE
WL_REG_ON: U?#4.AB7(PH2) ; port WIRELESS.WL_REG_ON
NetC?#40_1: C?#40.1 U?#3.R1(NRST_CORE)
NetR?#4_1: R?#4.1 U?#5.AA17(USB_RREF)
NetR?#5_1: R?#5.1 U?#6.K22(DDR_ZQ)

Not connected (* = marked no-connect by the designer): U?#3 U1(PWR_LP)*; U?#6 A20(DDR_DQ20)* A21(DDR_DQ23)* AA19(DDR_ATO)* AA20(DDR_DQ29)* AA21(DDR_DQ28)* AA22(DDR_DQM3)* AB20(DDR_DQ27)* AB21(DDR_DQ26)* B20(DDR_DQ19)* B21(DDR_DQ16)* B22(DDR_DQS2N)* C21(DDR_DQS2P)* C22(DDR_DQM2)* D20(DDR_DQ22)* D21(DDR_DQ17)* D22(DDR_DQ18)* E22(DDR_DQ21)* K21(DDR_DTO1)* L22(DDR_DTO0)* M19(DDR_A15)* V22(DDR_DQ24)* W20(DDR_DQ25)* W21(DDR_DQ31)* W22(DDR_DQ30)* Y21(DDR_DQS3P)* Y22(DDR_DQS3N)*; X?#2 1(NC)

### Buses and harness runs
bus BOOT[0..2] = port BOOT[0..2]
bus PA[1..7]
bus PA[10..15]
bus PB[0..2]
bus PB[5..9]
bus PC[0..3]
bus PC[4..7]
bus PD[4..6]
bus PD[8..11]
bus PE[0..2]
bus PE[6..15]
bus PF[9..15]
bus PG[0..5]
bus PG[7..14]
bus PH[4..9]
bus PH[10..15]
bus PI[0..9]
bus PI[11..15]
bus PJ[0..7]
bus PJ[8..15]
bus PK[0..3]
bus PK[4..7]
bus SDMMC1_D[0..3]
bus SDMMC2_D[0..7]

### Layout directives
differential pair: DDR_CLK_N, DDR_CLK_P, DDR_DQS0_N, DDR_DQS0_P, DDR_DQS1_N, DDR_DQS1_P, DSI_CK_N, DSI_CK_P, DSI_D0_N, DSI_D0_P, DSI_D1_N, DSI_D1_P, USB1_N, USB1_P, USB2_N, USB2_P

### Notes on the sheet
- Title
- Size:
- Date:
- A3
- Revision:
- Project Name:
- Sheet:
- of
- Drawn By:
- Checked By:
- www.logicboards.org

### Library data of the parts
C?#39-C?#44 = CAP_SMD: as C?#1 on sheet MPU Power; Supplier 1: Mouser; Manufacturer 1: *; Manufacturer Part Number 1: *; RoHS: Yes; Mount: Surface Mount; Package: *; Capacitance: *; Length: *; Lead Free: Lead Free; Supplier Part Number 1: *; Supplier 2: Digikey; Supplier Part Number 2: *
  C?#39 C?#44: Value: 100nF
  C?#40: Value: 10nF
  C?#41-C?#43: Value: 10pF
R?#3-R?#7 = RES_SMD: General Purpose Chip Resistor Thick Film; Supplier 1: Mouser; RoHS: Yes; Category: Resistors; RoHS Compliant: Yes; Resistance: *; Supplier 2: Digikey; Supplier Part Number 2: *; Package: *
  R?#3 R?#6 R?#7: Value: 100k
  R?#4: Value: 3k
  R?#5: Value: 240E
U?#3-U?#6 = STM32MP157CAA3: as U?#1 on sheet MPU Power; Supplier 1: Mouser; RoHS: Yes; Category: Microprocessors; Supplier Part Number 1: 511-STM32MP157CAA3; Supplier 2: Digi-Key; Supplier Part Number 2: STM32MP157CAA3-ND; Manufacturer Part Number 1: STM32MP157CAA3; Datasheet: https://www.st.com/resource/en/datasheet/stm32mp157c.pdf
X?#1 = TSX-3225 24.0000MF10Z-C3: CRYSTAL 24.00 MHZ 18PFSMD; Manufacturer 1: Epson; Frequency: 24MHz; Tolerance: 10ppm; Load Capacitance: 18pF; ESR (Equivalent Series Resistance): 40R; Drive Level: 200uW; Supplier 1: Mouser; Manufacturer Part Number 1: TSX-322524.0000MF10Z-C3; RoHS: Yes; Category: Crystals; Pricing 1: 1=0.39000, 10=0.31300, 50=0.31300, 100=0.25200, 1000=0.25200, 10000=0.25200 (USD); Mount: Surface Mount; Case/Package: SMD/SMT; Weight: 0.000564oz; Min Operating Temperature: -20°C; Max Operating Temperature: 75°C; Packaging: Tape and Reel; Package Quantity: 250; Termination: SMD/SMT; Frequency Stability: 10ppm; Frequency Tolerance: 10ppm; Series: TSX-3225; Length: 0.126inch; Width: 2.5mm; Height: 0.024inch; Lead Free: Lead Free; RoHS Compliant: Yes; ComponentLink1URL: https://datasheet.ciiva.com/4946/fa-238-238v-tsx-3225-e09x-4946452.pdf?src-supplier=Mouser; ComponentLink1Description: https://datasheet.ciiva.com/4946/fa-238-238v-tsx-3225-e09x-4946452.pdf?src-supplier=Mouser; Supplier 2: Digi-Key; Supplier Part Number 1: 732-322524MF10Z-C3; Supplier Part Number 2: SER4373DKR-ND
X?#2 = SiT1533AC-H5-DCC-32.768E: Oscillator MEMS 0.032768MHz ±75ppm (Stability) 15pF LVCMOS 52% 1.8V/2.5V/3.3V 4-Pin SMD T/R; Manufacturer 1: SiTime; Frequency: 32.768kHz; Max Supply Current: 1.3uA; Supplier 1: Mouser; Manufacturer Part Number 1: SIT1533AC-H5-DCC-32.768E; RoHS: Yes; Category: Oscillators; Pricing 1: 1=1.13000, 10=1.00000, 50=1.00000, 100=0.82700, 1000=0.59400, 10000=0.59400 (USD); Mount: Surface Mount; Case/Package: SMD/SMT; Number of Pins: 4; Min Operating Temperature: -10°C; Max Operating Temperature: 70°C; Packaging: Tape and Reel; Frequency Stability: 75ppm; Length: 0.079inch; Width: 0.047inch; Height: 0.024inch; RoHS Compliant: Yes; ComponentLink1URL: http://components.arrow.com/part/dataview/0323_07503286?src-supplier=Arrow+Europe; ComponentLink1Description: http://components.arrow.com/part/dataview/0323_07503286?src-supplier=Arrow+Europe; ComponentLink2URL: http://www.sitime.com/products/datasheets/sit1533/SiT1533-datasheet.pdf?src-supplier=Digi-Key; ComponentLink2Description: http://www.sitime.com/products/datasheets/sit1533/SiT1533-datasheet.pdf?src-supplier=Digi-Key; ComponentLink3URL: https://www.sitime.com/datasheet/SiT1533?src-supplier=Digi-Key; ComponentLink3Description: https://www.sitime.com/datasheet/SiT1533?src-supplier=Digi-Key; Supplier 2: Digi-Key; Pricing 2: 1=1.05000, 10=0.92900, 50=0.86860, 100=0.76760, 500=0.72720 (USD); Supplier Part Number 1: 788-1533ACH5DCC32.7E; Supplier Part Number 2: 1473-1516-1-ND; Datasheet: https://www.mouser.in/datasheet/2/371/SiT1533_rev1.4_03202018-1324419.pdf

## Sheet DDR3L Memory.SchDoc
size A4
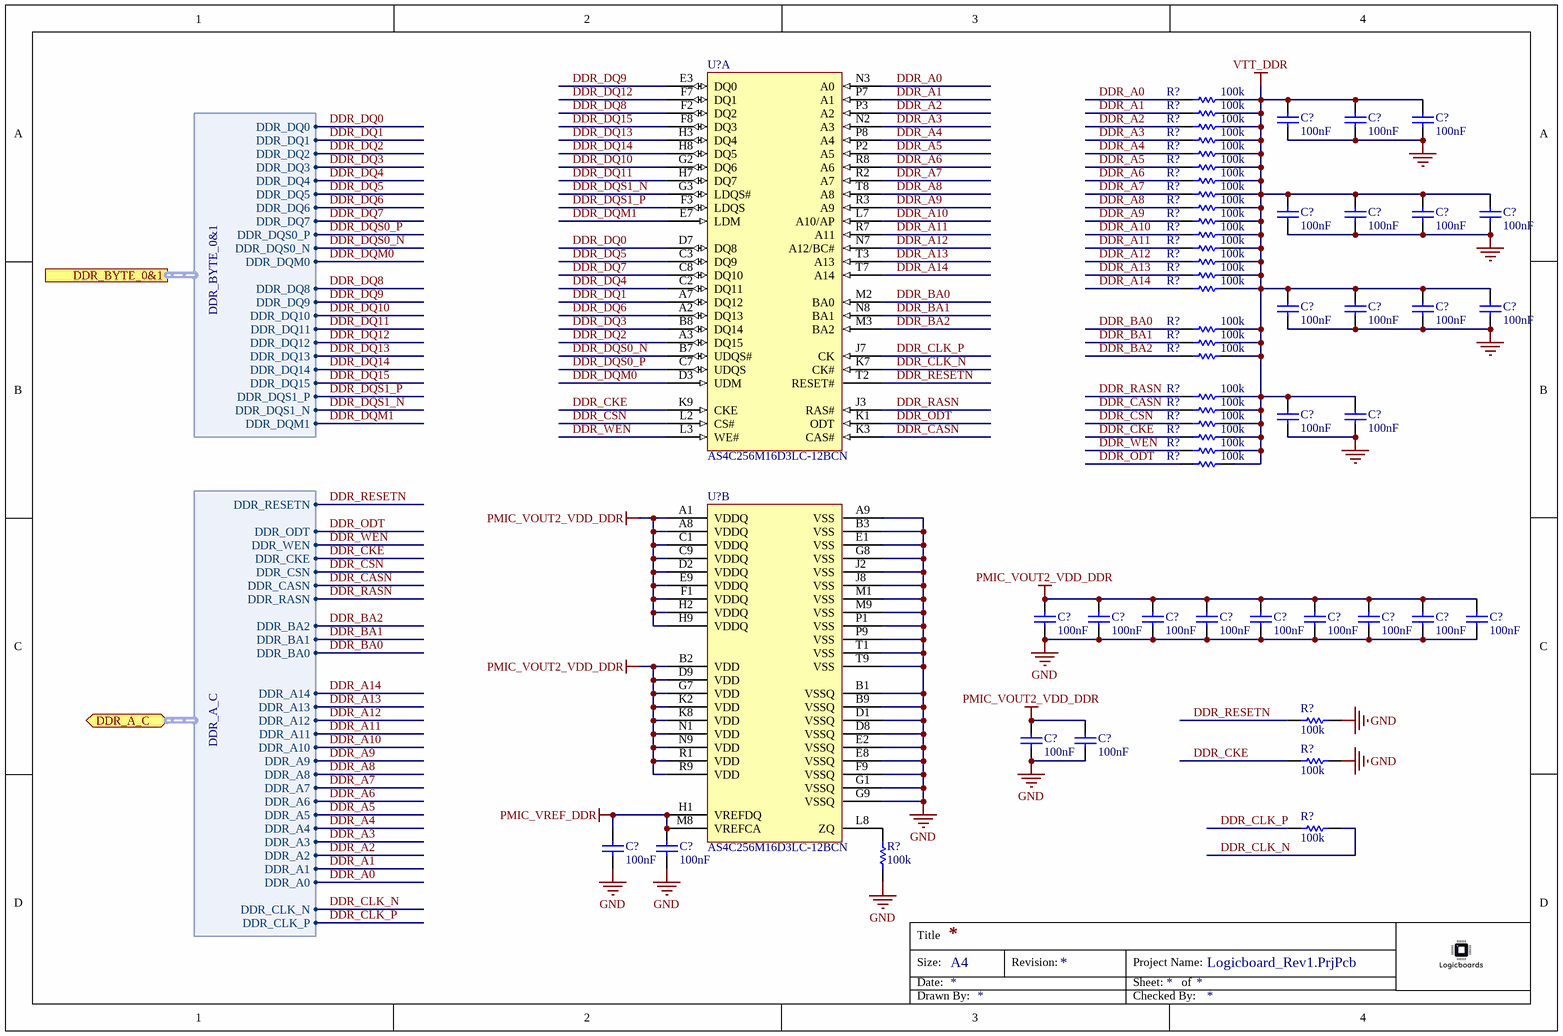
[diagram p4: DDR3L Memory.SchDoc]

### Parts
(Parts that share a designator on the sheet are numbered #1, #2 ... from top to bottom, then left to right.)
C?#45  100nF
C?#46  100nF
C?#47  100nF
C?#48  100nF
C?#49  100nF
C?#50  100nF
C?#51  100nF
C?#52  100nF
C?#53  100nF
C?#54  100nF
C?#55  100nF
C?#56  100nF
C?#57  100nF
C?#58  100nF
C?#59  100nF
C?#60  100nF
C?#61  100nF
C?#62  100nF
C?#63  100nF
C?#64  100nF
C?#65  100nF
C?#66  100nF
C?#67  100nF
C?#68  100nF
C?#69  100nF
C?#70  100nF
R?#8  100k
R?#9  100k
R?#10  100k
R?#11  100k
R?#12  100k
R?#13  100k
R?#14  100k
R?#15  100k
R?#16  100k
R?#17  100k
R?#18  100k
R?#19  100k
R?#20  100k
R?#21  100k
R?#22  100k
R?#23  100k
R?#24  100k
R?#25  100k
R?#26  100k
R?#27  100k
R?#28  100k
R?#29  100k
R?#30  100k
R?#31  100k
R?#32  100k
R?#33  100k
R?#34  100k
R?#35  100k
U?#7  AS4C256M16D3LC-12BCN  (part A of 2)
U?#8  AS4C256M16D3LC-12BCN  (part B of 2)

### Ports
DDR_A_C (bidir, harness DDR_A_C), DDR_BYTE_0&1 (harness DDR_BYTE_0&1)

### Harnesses
DDR_BYTE_0&1: DDR_DQ0, DDR_DQ1, DDR_DQ2, DDR_DQ3, DDR_DQ4, DDR_DQ5, DDR_DQ6, DDR_DQ7, DDR_DQS0_P, DDR_DQS0_N, DDR_DQM0, DDR_DQ8, DDR_DQ9, DDR_DQ10, DDR_DQ11, DDR_DQ12, DDR_DQ13, DDR_DQ14, DDR_DQ15, DDR_DQS1_P, DDR_DQS1_N, DDR_DQM1
DDR_A_C: DDR_CLK_P, DDR_CLK_N, DDR_A0, DDR_A1, DDR_A2, DDR_A3, DDR_A4, DDR_A5, DDR_A6, DDR_A7, DDR_A8, DDR_A9, DDR_A10, DDR_A11, DDR_A12, DDR_A13, DDR_A14, DDR_BA0, DDR_BA1, DDR_BA2, DDR_RASN, DDR_CASN, DDR_CSN, DDR_CKE, DDR_WEN, DDR_ODT, DDR_RESETN

### Nets
GND: C?#45.2 C?#46.2 C?#47.2 C?#48.2 C?#49.2 C?#50.2 C?#51.2 C?#52.2 C?#53.2 C?#54.2 C?#55.2 C?#56.2 C?#57.2 C?#58.2 C?#59.2 C?#60.2 C?#61.2 C?#62.2 C?#63.2 C?#64.2 C?#65.2 C?#66.2 C?#67.2 C?#68.2 C?#69.2 C?#70.2 R?#32.2 R?#33.2 R?#35.1 U?#8.A9(VSS) U?#8.B1(VSSQ) U?#8.B3(VSS) U?#8.B9(VSSQ) U?#8.D1(VSSQ) U?#8.D8(VSSQ) U?#8.E1(VSS) U?#8.E2(VSSQ) U?#8.E8(VSSQ) U?#8.F9(VSSQ) U?#8.G1(VSSQ) U?#8.G8(VSS) U?#8.G9(VSSQ) U?#8.J2(VSS) U?#8.J8(VSS) U?#8.M1(VSS) U?#8.M9(VSS) U?#8.P1(VSS) U?#8.P9(VSS) U?#8.T1(VSS) U?#8.T9(VSS)
PMIC_VOUT2_VDD_DDR: C?#58.1 C?#59.1 C?#60.1 C?#61.1 C?#62.1 C?#63.1 C?#64.1 C?#65.1 C?#66.1 C?#67.1 C?#68.1 U?#8.A1(VDDQ) U?#8.A8(VDDQ) U?#8.B2(VDD) U?#8.C1(VDDQ) U?#8.C9(VDDQ) U?#8.D2(VDDQ) U?#8.D9(VDD) U?#8.E9(VDDQ) U?#8.F1(VDDQ) U?#8.G7(VDD) U?#8.H2(VDDQ) U?#8.H9(VDDQ) U?#8.K2(VDD) U?#8.K8(VDD) U?#8.N1(VDD) U?#8.N9(VDD) U?#8.R1(VDD) U?#8.R9(VDD)
PMIC_VREF_DDR: C?#69.1 C?#70.1 U?#8.H1(VREFDQ) U?#8.M8(VREFCA)
VTT_DDR: C?#45.1 C?#46.1 C?#47.1 C?#48.1 C?#49.1 C?#50.1 C?#51.1 C?#52.1 C?#53.1 C?#54.1 C?#55.1 C?#56.1 C?#57.1 R?#8.2 R?#9.2 R?#10.2 R?#11.2 R?#12.2 R?#13.2 R?#14.2 R?#15.2 R?#16.2 R?#17.2 R?#18.2 R?#19.2 R?#20.2 R?#21.2 R?#22.2 R?#23.2 R?#24.2 R?#25.2 R?#26.2 R?#27.2 R?#28.2 R?#29.2 R?#30.2 R?#31.2
DDR_A0: R?#8.1 U?#7.N3(A0) ; port DDR_A_C.DDR_A0
DDR_A1: R?#9.1 U?#7.P7(A1) ; port DDR_A_C.DDR_A1
DDR_A2: R?#10.1 U?#7.P3(A2) ; port DDR_A_C.DDR_A2
DDR_A3: R?#11.1 U?#7.N2(A3) ; port DDR_A_C.DDR_A3
DDR_A4: R?#12.1 U?#7.P8(A4) ; port DDR_A_C.DDR_A4
DDR_A5: R?#13.1 U?#7.P2(A5) ; port DDR_A_C.DDR_A5
DDR_A6: R?#14.1 U?#7.R8(A6) ; port DDR_A_C.DDR_A6
DDR_A7: R?#15.1 U?#7.R2(A7) ; port DDR_A_C.DDR_A7
DDR_A8: R?#16.1 U?#7.T8(A8) ; port DDR_A_C.DDR_A8
DDR_A9: R?#17.1 U?#7.R3(A9) ; port DDR_A_C.DDR_A9
DDR_A10: R?#18.1 U?#7.L7(A10/AP) ; port DDR_A_C.DDR_A10
DDR_A11: R?#19.1 U?#7.R7(A11) ; port DDR_A_C.DDR_A11
DDR_A12: R?#20.1 U?#7.N7(A12/BC#) ; port DDR_A_C.DDR_A12
DDR_A13: R?#21.1 U?#7.T3(A13) ; port DDR_A_C.DDR_A13
DDR_A14: R?#22.1 U?#7.T7(A14) ; port DDR_A_C.DDR_A14
DDR_BA0: R?#23.1 U?#7.M2(BA0) ; port DDR_A_C.DDR_BA0
DDR_BA1: R?#24.1 U?#7.N8(BA1) ; port DDR_A_C.DDR_BA1
DDR_BA2: R?#25.1 U?#7.M3(BA2) ; port DDR_A_C.DDR_BA2
DDR_CASN: R?#27.1 U?#7.K3(CAS#) ; port DDR_A_C.DDR_CASN
DDR_CKE: R?#29.1 R?#33.1 U?#7.K9(CKE) ; port DDR_A_C.DDR_CKE
DDR_CLK_N: R?#34.2 U?#7.K7(CK#) ; port DDR_A_C.DDR_CLK_N
DDR_CLK_P: R?#34.1 U?#7.J7(CK) ; port DDR_A_C.DDR_CLK_P
DDR_CSN: R?#28.1 U?#7.L2(CS#) ; port DDR_A_C.DDR_CSN
DDR_DQ0: U?#7.D7(DQ8) ; port DDR_BYTE_0&1.DDR_DQ0
DDR_DQ1: U?#7.A7(DQ12) ; port DDR_BYTE_0&1.DDR_DQ1
DDR_DQ2: U?#7.A3(DQ15) ; port DDR_BYTE_0&1.DDR_DQ2
DDR_DQ3: U?#7.B8(DQ14) ; port DDR_BYTE_0&1.DDR_DQ3
DDR_DQ4: U?#7.C2(DQ11) ; port DDR_BYTE_0&1.DDR_DQ4
DDR_DQ5: U?#7.C3(DQ9) ; port DDR_BYTE_0&1.DDR_DQ5
DDR_DQ6: U?#7.A2(DQ13) ; port DDR_BYTE_0&1.DDR_DQ6
DDR_DQ7: U?#7.C8(DQ10) ; port DDR_BYTE_0&1.DDR_DQ7
DDR_DQ8: U?#7.F2(DQ2) ; port DDR_BYTE_0&1.DDR_DQ8
DDR_DQ9: U?#7.E3(DQ0) ; port DDR_BYTE_0&1.DDR_DQ9
DDR_DQ10: U?#7.G2(DQ6) ; port DDR_BYTE_0&1.DDR_DQ10
DDR_DQ11: U?#7.H7(DQ7) ; port DDR_BYTE_0&1.DDR_DQ11
DDR_DQ12: U?#7.F7(DQ1) ; port DDR_BYTE_0&1.DDR_DQ12
DDR_DQ13: U?#7.H3(DQ4) ; port DDR_BYTE_0&1.DDR_DQ13
DDR_DQ14: U?#7.H8(DQ5) ; port DDR_BYTE_0&1.DDR_DQ14
DDR_DQ15: U?#7.F8(DQ3) ; port DDR_BYTE_0&1.DDR_DQ15
DDR_DQM0: U?#7.D3(UDM) ; port DDR_BYTE_0&1.DDR_DQM0
DDR_DQM1: U?#7.E7(LDM) ; port DDR_BYTE_0&1.DDR_DQM1
DDR_DQS0_N: U?#7.B7(UDQS#) ; port DDR_BYTE_0&1.DDR_DQS0_N
DDR_DQS0_P: U?#7.C7(UDQS) ; port DDR_BYTE_0&1.DDR_DQS0_P
DDR_DQS1_N: U?#7.G3(LDQS#) ; port DDR_BYTE_0&1.DDR_DQS1_N
DDR_DQS1_P: U?#7.F3(LDQS) ; port DDR_BYTE_0&1.DDR_DQS1_P
DDR_ODT: R?#31.1 U?#7.K1(ODT) ; port DDR_A_C.DDR_ODT
DDR_RASN: R?#26.1 U?#7.J3(RAS#) ; port DDR_A_C.DDR_RASN
DDR_RESETN: R?#32.1 U?#7.T2(RESET#) ; port DDR_A_C.DDR_RESETN
DDR_WEN: R?#30.1 U?#7.L3(WE#) ; port DDR_A_C.DDR_WEN
NetR?#35_2: R?#35.2 U?#8.L8(ZQ)

Not connected (* = marked no-connect by the designer): U?#8 J1(NC1) J9(NC2) L1(NC3) L9(NC4) M7(NC5)

### Notes on the sheet
- Title
- Size:
- Date:
- A4
- Revision:
- Sheet:
- Project Name:
- of
- Drawn By:
- Checked By:

### Library data of the parts
C?#45-C?#70 = CAP_SMD: as C?#1 on sheet MPU Power; Supplier 1: Mouser; Manufacturer 1: *; Manufacturer Part Number 1: *; RoHS: Yes; Mount: Surface Mount; Package: *; Capacitance: *; Length: *; Lead Free: Lead Free; Supplier Part Number 1: *; Supplier 2: Digikey; Supplier Part Number 2: *; Value: 100nF
R?#8-R?#35 = RES_SMD: General Purpose Chip Resistor Thick Film; Supplier 1: Mouser; RoHS: Yes; Category: Resistors; RoHS Compliant: Yes; Resistance: *; Supplier 2: Digikey; Supplier Part Number 2: *; Package: *; Value: 100k
U?#7 U?#8 = AS4C256M16D3LC-12BCN: IC DDR3L 4Gb Memory; Manufacturer 1: Alliance Memory; Manufacturer Part Number 1: AS4C256M16D3-12BCN; Address Bus Width: 15b; Access Time: 20ns; Memory Type: RAM,DDR3 SDRAM; Frequency: 800MHz; Interface: Parallel; Operating Supply Voltage: 1.5V; Supplier 1: Mouser; RoHS: Yes; Category: Memory; Case/Package: TFBGA; Number of Pins: 96; Min Operating Temperature: 0°C; Max Operating Temperature: 95°C; Packaging: Tray; Density: 4Gb; Max Frequency: 800MHz; Lead Free: Lead Free; RoHS Compliant: Yes; ComponentLink1URL: https://datasheet.ciiva.com/48497/4gb-as4c256m16d3-48497159.pdf?src-supplier=Avnet; ComponentLink1Description: https://datasheet.ciiva.com/48497/4gb-as4c256m16d3-48497159.pdf?src-supplier=Avnet; Supplier Part Number 1: 913-A4C256M16D312BCN; Datasheet: https://www.mouser.in/datasheet/2/12/AllianceMemory_4G_DDR3L_AS4C256M16D3LC_March2020_R-1826861.pdf; Supplier 2: Digikey; Supplier Part Number 2: *

## Sheet Power Management IC.SchDoc
size A3
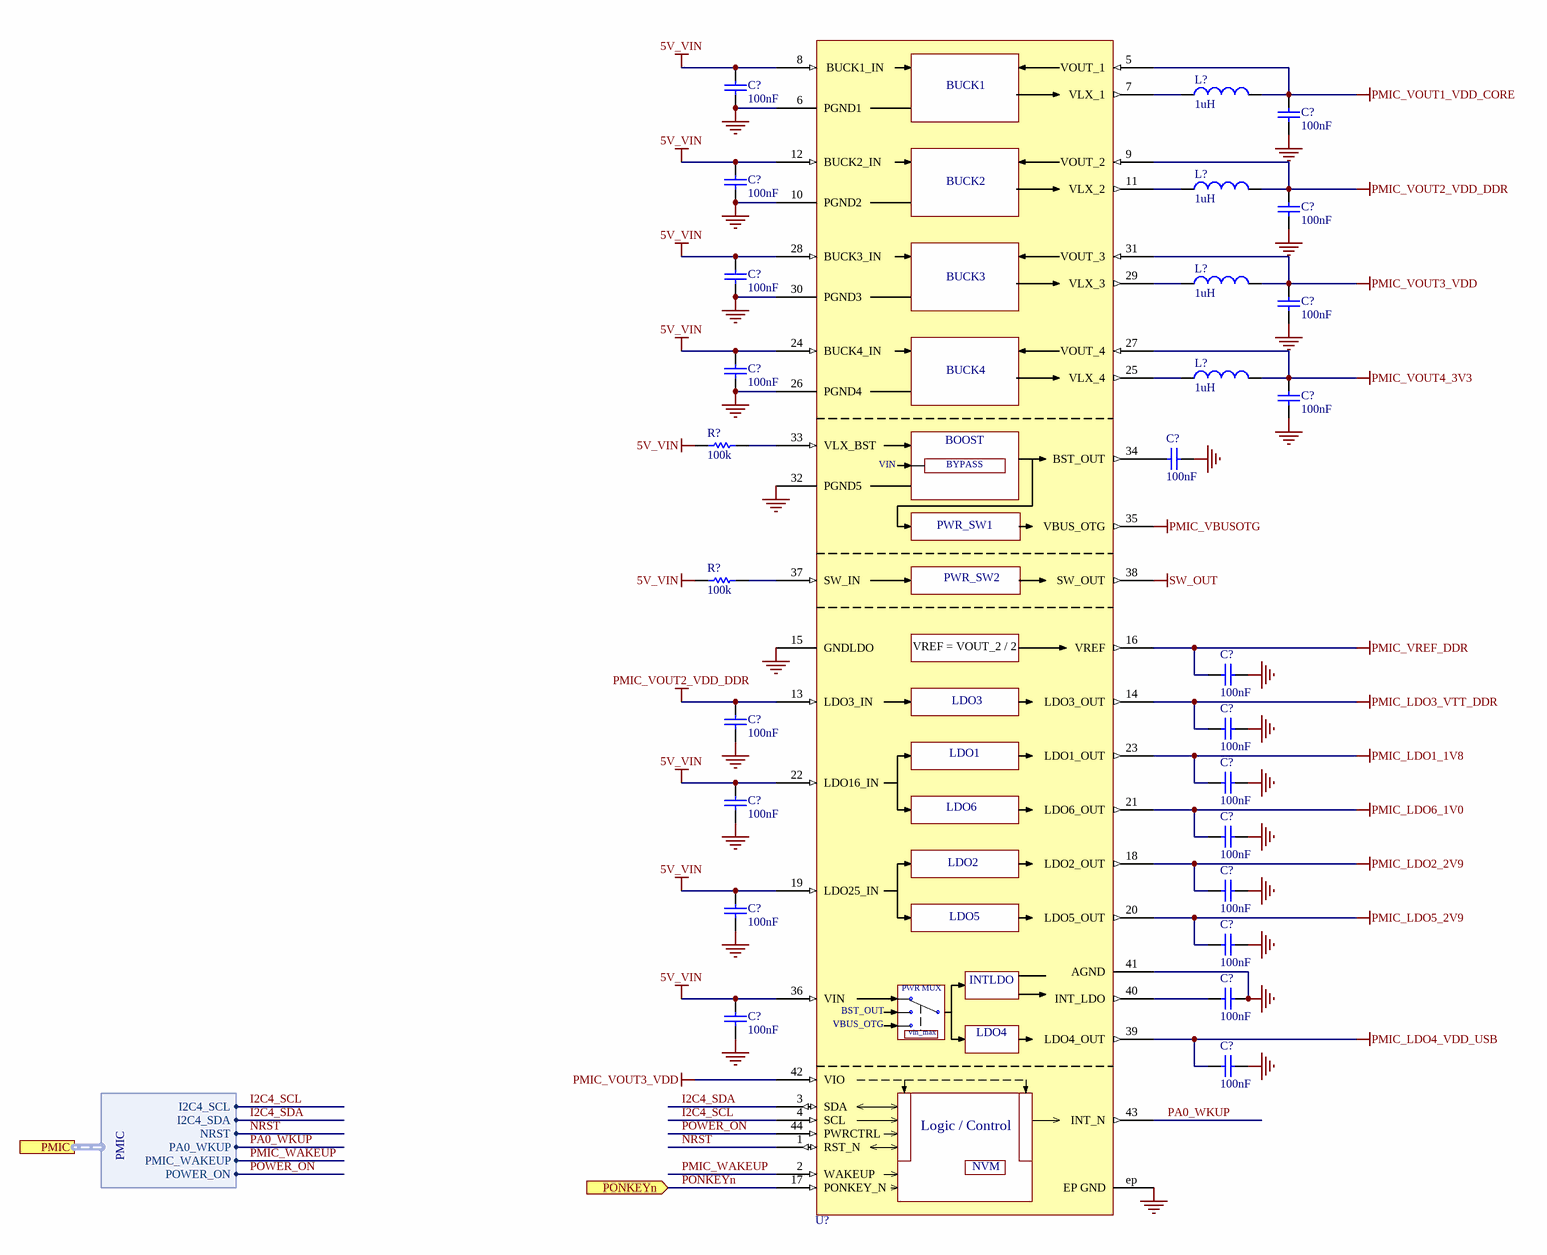
[diagram p5: Power Management IC.SchDoc]

### Parts
(Parts that share a designator on the sheet are numbered #1, #2 ... from top to bottom, then left to right.)
C?#71  100nF
C?#72  100nF
C?#73  100nF
C?#74  100nF
C?#75  100nF
C?#76  100nF
C?#77  100nF
C?#78  100nF
C?#79  100nF
C?#80  100nF
C?#81  100nF
C?#82  100nF
C?#83  100nF
C?#84  100nF
C?#85  100nF
C?#86  100nF
C?#87  100nF
C?#88  100nF
C?#89  100nF
C?#90  100nF
C?#91  100nF
L?#1  1uH
L?#2  1uH
L?#3  1uH
L?#4  1uH
R?#36  100k
R?#37  100k
U?#9  STPMIC1BPQR  (value not drawn)

### Ports
PMIC (harness PMIC), PONKEYn (in)

### Harnesses
PMIC: I2C4_SCL, I2C4_SDA, NRST, PA0_WKUP, PMIC_WAKEUP, POWER_ON

### Nets
5V_VIN: C?#71.1 C?#73.1 C?#75.1 C?#77.1 C?#84.1 C?#87.1 C?#90.1 R?#36.1 R?#37.1 U?#9.8(BUCK1_IN) U?#9.12(BUCK2_IN) U?#9.19(LDO25_IN) U?#9.22(LDO16_IN) U?#9.24(BUCK4_IN) U?#9.28(BUCK3_IN) U?#9.36(VIN)
GND: C?#71.2 C?#72.2 C?#73.2 C?#74.2 C?#75.2 C?#76.2 C?#77.2 C?#78.2 C?#79.1 C?#80.1 C?#81.2 C?#82.1 C?#83.1 C?#84.2 C?#85.1 C?#86.1 C?#87.2 C?#88.1 C?#89.1 C?#90.2 C?#91.1 U?#9.6(PGND1) U?#9.10(PGND2) U?#9.15(GNDLDO) U?#9.26(PGND4) U?#9.30(PGND3) U?#9.32(PGND5) U?#9.41(AGND) U?#9.ep(EP_GND)
PMIC_LDO1_1V8: C?#83.2 U?#9.23(LDO1_OUT)
PMIC_LDO2_2V9: C?#86.2 U?#9.18(LDO2_OUT)
PMIC_LDO3_VTT_DDR: C?#82.2 U?#9.14(LDO3_OUT)
PMIC_LDO4_VDD_USB: C?#91.2 U?#9.39(LDO4_OUT)
PMIC_LDO5_2V9: C?#88.2 U?#9.20(LDO5_OUT)
PMIC_LDO6_1V0: C?#85.2 U?#9.21(LDO6_OUT)
PMIC_VBUSOTG: U?#9.35(VBUS_OTG)
PMIC_VOUT1_VDD_CORE: C?#72.1 L?#1.2 U?#9.5(VOUT_1)
PMIC_VOUT2_VDD_DDR: C?#74.1 C?#81.1 L?#2.2 U?#9.9(VOUT_2) U?#9.13(LDO3_IN)
PMIC_VOUT3_VDD: C?#76.1 L?#3.2 U?#9.31(VOUT_3) U?#9.42(VIO)
PMIC_VOUT4_3V3: C?#78.1 L?#4.2 U?#9.27(VOUT_4)
PMIC_VREF_DDR: C?#80.2 U?#9.16(VREF)
SW_OUT: U?#9.38(SW_OUT)
I2C4_SCL: U?#9.4(SCL) ; port PMIC.I2C4_SCL
I2C4_SDA: U?#9.3(SDA) ; port PMIC.I2C4_SDA
NRST: U?#9.1(RST_N) ; port PMIC.NRST
PA0_WKUP: U?#9.43(INT_N) ; port PMIC.PA0_WKUP
PMIC_WAKEUP: U?#9.2(WAKEUP) ; port PMIC.PMIC_WAKEUP
PONKEYn: U?#9.17(PONKEY_N) ; port PONKEYn
POWER_ON: U?#9.44(PWRCTRL) ; port PMIC.POWER_ON
NetC?#79_2: C?#79.2 U?#9.34(BST_OUT)
NetC?#89_2: C?#89.2 U?#9.40(INT_LDO)
NetL?#1_1: L?#1.1 U?#9.7(VLX_1)
NetL?#2_1: L?#2.1 U?#9.11(VLX_2)
NetL?#3_1: L?#3.1 U?#9.29(VLX_3)
NetL?#4_1: L?#4.1 U?#9.25(VLX_4)
NetR?#36_2: R?#36.2 U?#9.33(VLX_BST)
NetR?#37_2: R?#37.2 U?#9.37(SW_IN)

### Notes on the sheet
- Title
- Size:
- Date:
- A3
- Revision:
- Project Name:
- Sheet:
- of
- Drawn By:
- Checked By:
- www.logicboards.org
- (in symbol STPMIC1BPQR) BUCK1; BUCK2; BUCK3; BUCK4; BOOST; BYPASS; PWR_SW1; PWR_SW2; VREF = VOUT_2 / 2; LDO3; LDO1; LDO6; LDO2; LDO5; INTLDO; PWR MUX; vin_max; LDO4; Logic / Control; NVM

### Library data of the parts
C?#71-C?#91 = CAP_SMD: as C?#1 on sheet MPU Power; Supplier 1: Mouser; Manufacturer 1: *; Manufacturer Part Number 1: *; RoHS: Yes; Mount: Surface Mount; Package: *; Capacitance: *; Length: *; Lead Free: Lead Free; Supplier Part Number 1: *; Supplier 2: Digikey; Supplier Part Number 2: *; Value: 100nF
L?#1-L?#4 = IND_SMD: Inductor SMD; Manufacturer Part Number 1: MGV2520101R5M-10; Supplier 1: Mouser; RoHS: Yes; Category: Fixed Inductors; RoHS Compliant: Yes; Supplier 2: Digi-Key; Supplier Part Number 1: 739-MGV2520101R5M-10; Supplier Part Number 2: 240-3070-1-ND; Value: 1uH
R?#36 R?#37 = RES_SMD: General Purpose Chip Resistor Thick Film; Supplier 1: Mouser; RoHS: Yes; Category: Resistors; RoHS Compliant: Yes; Resistance: *; Supplier 2: Digikey; Supplier Part Number 2: *; Package: *; Value: 100k
U?#9 = STPMIC1BPQR: IC ST MPU Power Management IC; Manufacturer 1: STMicroelectronics; Supplier 1: Mouser; Manufacturer Part Number 1: STPMIC1BPQR; RoHS: Yes; Category: Power Management ICs; Supplier 2: Digi-Key; Datasheet: https://www.st.com/resource/en/datasheet/stpmic1.pdf; Supplier Part Number 1: 511-STPMIC1BPQR; Supplier Part Number 2: 497-STPMIC1BPQRDKR-ND

## Sheet eMMC FLASH.SchDoc
size A4
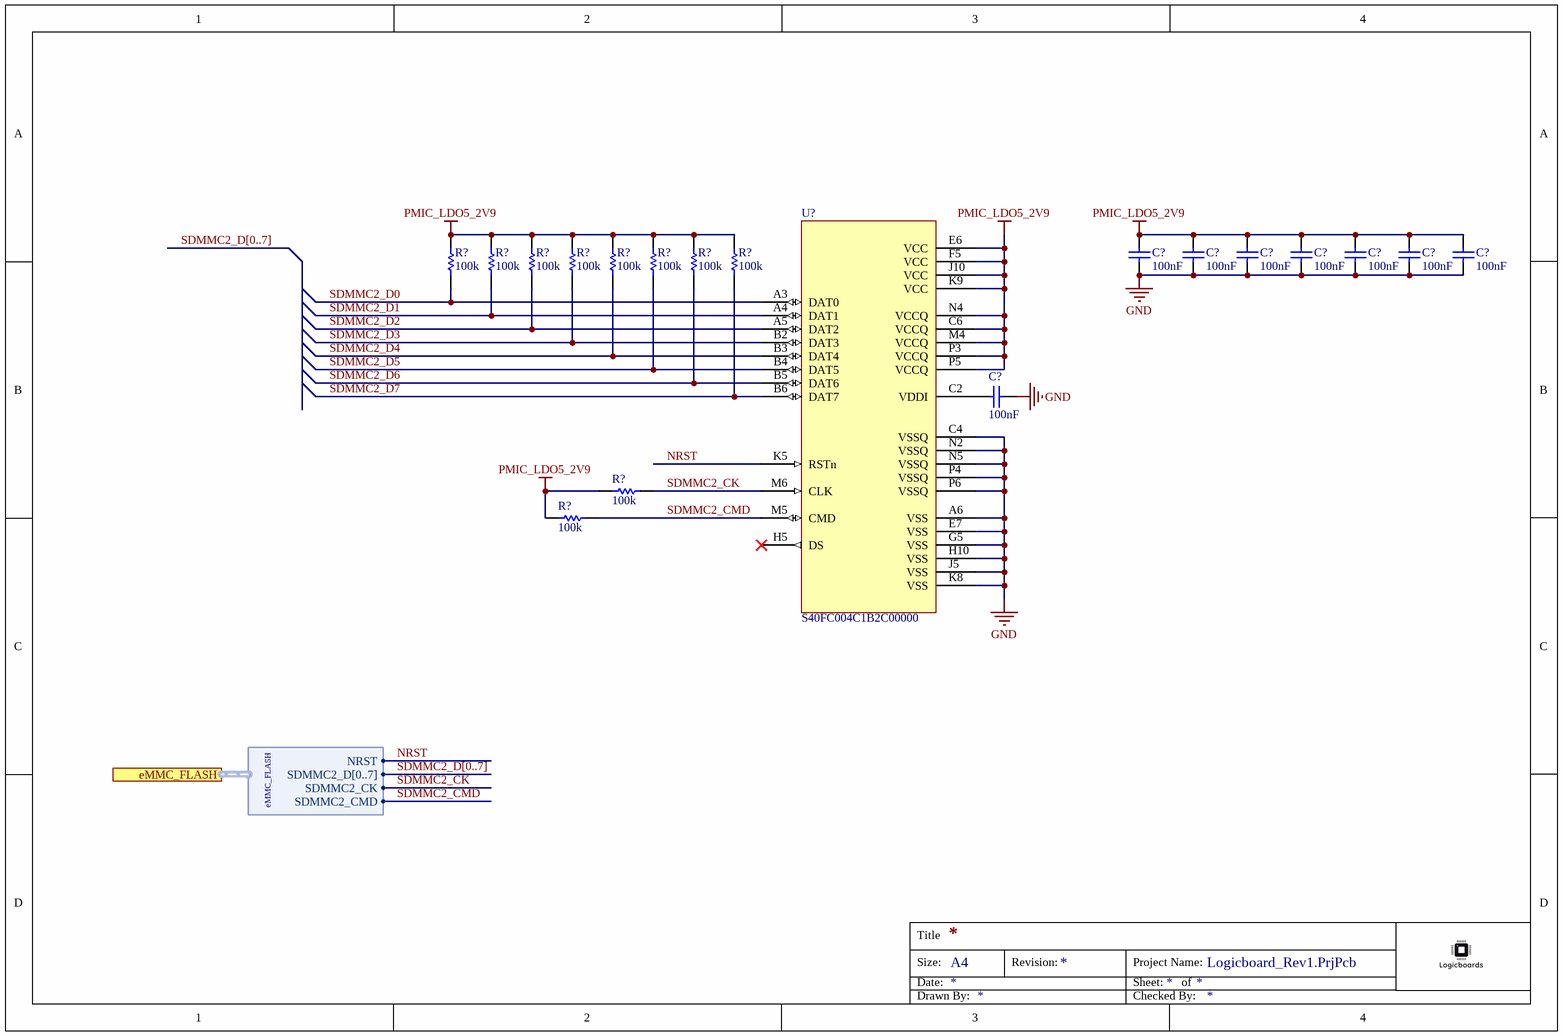
[diagram p6: eMMC FLASH.SchDoc]

### Parts
(Parts that share a designator on the sheet are numbered #1, #2 ... from top to bottom, then left to right.)
C?#92  100nF
C?#93  100nF
C?#94  100nF
C?#95  100nF
C?#96  100nF
C?#97  100nF
C?#98  100nF
C?#99  100nF
R?#38  100k
R?#39  100k
R?#40  100k
R?#41  100k
R?#42  100k
R?#43  100k
R?#44  100k
R?#45  100k
R?#46  100k
R?#47  100k
U?#10  S40FC004C1B2C00000

### Ports
eMMC_FLASH (harness eMMC_FLASH)

### Harnesses
eMMC_FLASH: SDMMC2_D[0..7], SDMMC2_CK, SDMMC2_CMD, NRST

### Nets
GND: C?#92.2 C?#93.2 C?#94.2 C?#95.2 C?#96.2 C?#97.2 C?#98.2 C?#99.1 U?#10.A6(VSS) U?#10.C4(VSSQ) U?#10.E7(VSS) U?#10.G5(VSS) U?#10.H10(VSS) U?#10.J5(VSS) U?#10.K8(VSS) U?#10.N2(VSSQ) U?#10.N5(VSSQ) U?#10.P4(VSSQ) U?#10.P6(VSSQ)
PMIC_LDO5_2V9: C?#92.1 C?#93.1 C?#94.1 C?#95.1 C?#96.1 C?#97.1 C?#98.1 R?#38.2 R?#39.2 R?#40.2 R?#41.2 R?#42.2 R?#43.2 R?#44.2 R?#45.2 R?#46.1 R?#47.1 U?#10.C6(VCCQ) U?#10.E6(VCC) U?#10.F5(VCC) U?#10.J10(VCC) U?#10.K9(VCC) U?#10.M4(VCCQ) U?#10.N4(VCCQ) U?#10.P3(VCCQ) U?#10.P5(VCCQ)
NRST: U?#10.K5(RSTn) ; port eMMC_FLASH.NRST
SDMMC2_CK: R?#46.2 U?#10.M6(CLK) ; port eMMC_FLASH.SDMMC2_CK
SDMMC2_CMD: R?#47.2 U?#10.M5(CMD) ; port eMMC_FLASH.SDMMC2_CMD
SDMMC2_D0: R?#38.1 U?#10.A3(DAT0)
SDMMC2_D1: R?#39.1 U?#10.A4(DAT1)
SDMMC2_D2: R?#40.1 U?#10.A5(DAT2)
SDMMC2_D3: R?#41.1 U?#10.B2(DAT3)
SDMMC2_D4: R?#42.1 U?#10.B3(DAT4)
SDMMC2_D5: R?#43.1 U?#10.B4(DAT5)
SDMMC2_D6: R?#44.1 U?#10.B5(DAT6)
SDMMC2_D7: R?#45.1 U?#10.B6(DAT7)
NetC?#99_2: C?#99.2 U?#10.C2(VDDI)

Not connected (* = marked no-connect by the designer): U?#10 A1(NC) A2(NC) A7(RFU) A8(NC) A9(NC) A10(NC) A11(NC) A12(NC) A13(NC) A14(NC) B1(NC) B7(NC) B8(NC) B9(NC) B10(NC) B11(NC) B12(NC) B13(NC) B14(NC) C1(NC) C3(NC) C5(NC) C7(NC) C8(NC) C9(NC) C10(NC) C11(NC) C12(NC) C13(NC) C14(NC) D1(NC) D2(NC) D3(NC) D4(NC) D12(NC) D13(NC) D14(NC) E1(NC) E2(NC) E3(NC) E5(RFU) E8(RFU) E9(RFU) E10(RFU) E12(NC) E13(NC) E14(NC) F1(NC) F2(NC) F3(NC) F10(RFU) F12(NC) F13(NC) F14(NC) G1(NC) G2(NC) G3(RFU) G10(RFU) G12(NC) G13(NC) G14(NC) H1(NC) H2(NC) H3(NC) H5(DS)* H12(NC) H13(NC) H14(NC) J1(NC) J2(NC) J3(NC) J12(NC) J13(NC) J14(NC) K1(NC) K2(NC) K3(NC) K6(RFU) K7(RFU) K10(RFU) K12(NC) K13(NC) K14(NC) L1(NC) L2(NC) L3(NC) L12(NC) L13(NC) L14(NC) M1(NC) M2(NC) M3(NC) M7(NC) M8(NC) M9(NC) M10(NC) M11(NC) M12(NC) M13(NC) M14(NC) N1(NC) N3(NC) N6(NC) N7(NC) N8(NC) N9(NC) N10(NC) N11(NC) N12(NC) N13(NC) N14(NC) P1(NC) P2(NC) P7(RFU) P8(NC) P9(NC) P10(RFU) P11(NC) P12(NC) P13(NC) P14(NC)

### Buses and harness runs
bus SDMMC2_D[0..7]

### Notes on the sheet
- Title
- Size:
- Date:
- A4
- Revision:
- Sheet:
- Project Name:
- of
- Drawn By:
- Checked By:

### Library data of the parts
C?#92-C?#99 = CAP_SMD: as C?#1 on sheet MPU Power; Supplier 1: Mouser; Manufacturer 1: *; Manufacturer Part Number 1: *; RoHS: Yes; Mount: Surface Mount; Package: *; Capacitance: *; Length: *; Lead Free: Lead Free; Supplier Part Number 1: *; Supplier 2: Digikey; Supplier Part Number 2: *; Value: 100nF
R?#38-R?#47 = RES_SMD: General Purpose Chip Resistor Thick Film; Supplier 1: Mouser; RoHS: Yes; Category: Resistors; RoHS Compliant: Yes; Resistance: *; Supplier 2: Digikey; Supplier Part Number 2: *; Package: *; Value: 100k
U?#10 = S40FC004C1B2C00000: IC eMMC 4GB, 3.3V Flash; Manufacturer 1: SKYHIGH MEMORY; Supplier 1: Mouser; Manufacturer Part Number 1: S40FC004C1B2C00000; RoHS: No; Pricing 1: 1=7.44000, 10=6.82000, 50=5.91000, 100=5.58000, 1000=4.19000, 10000=4.19000 (USD); Datasheet: http://www.skyhighmemory.com/download/dataSheet/002-01112.pdf; Supplier Part Number 1: 727-S40FC004C1B2C000; Supplier 2: Digikey; Supplier Part Number 2: *

## Sheet WLAN and Bluetooth.SchDoc
size A4
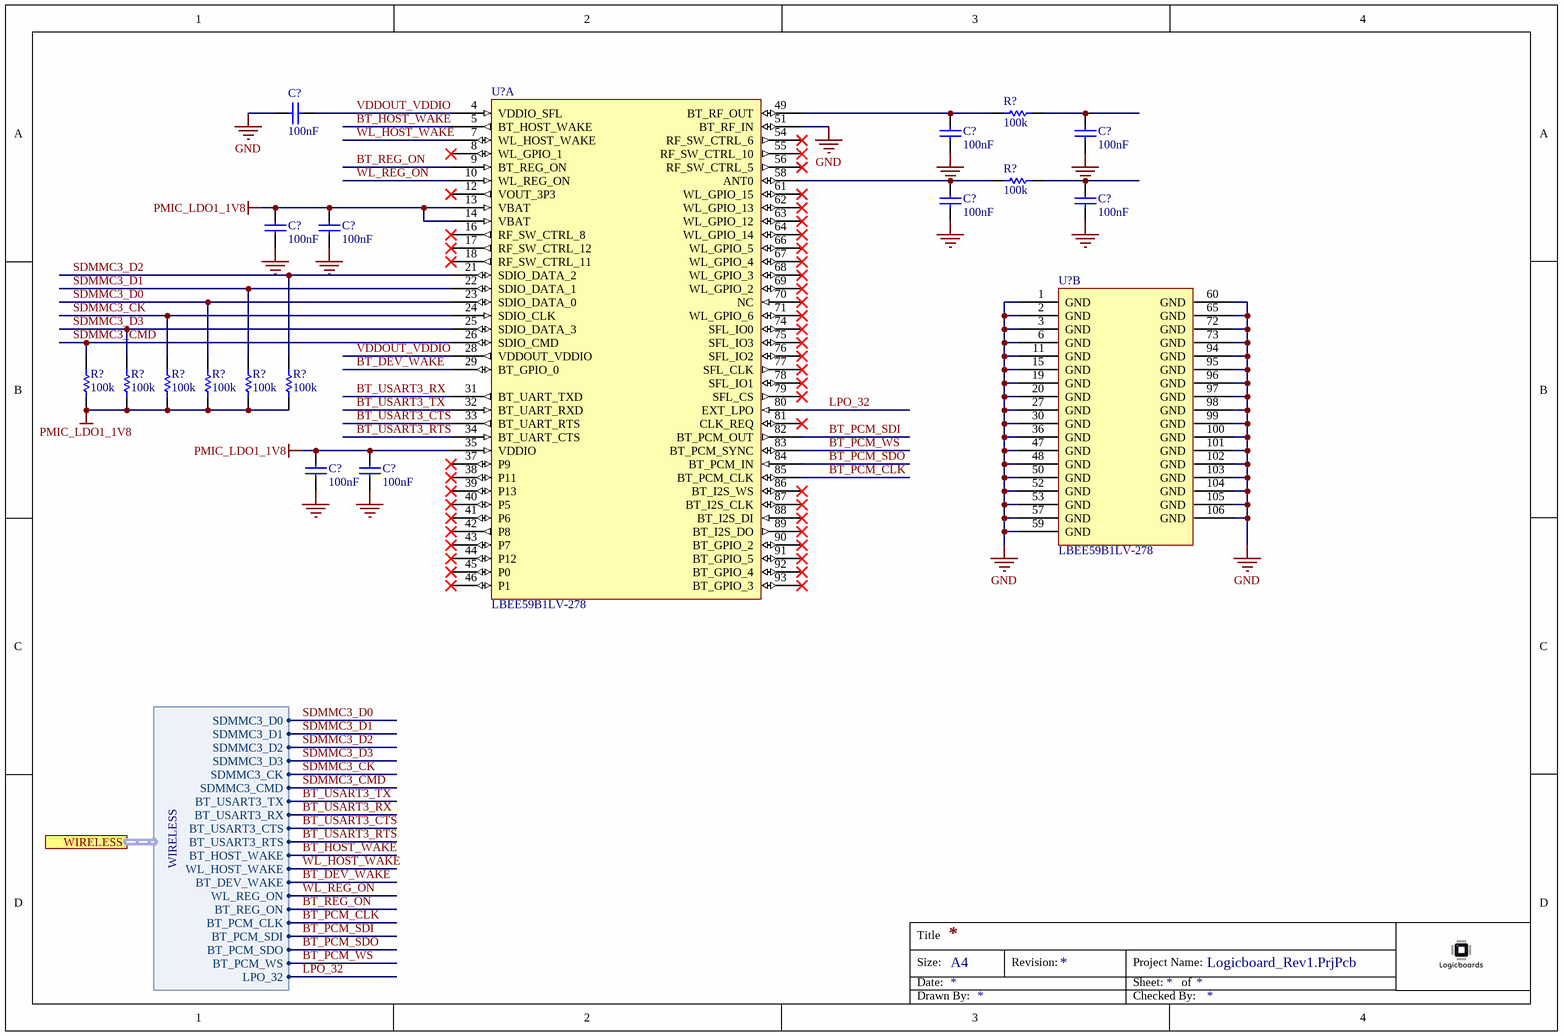
[diagram p7: WLAN and Bluetooth.SchDoc]

### Parts
(Parts that share a designator on the sheet are numbered #1, #2 ... from top to bottom, then left to right.)
C?#100  100nF
C?#101  100nF
C?#102  100nF
C?#103  100nF
C?#104  100nF
C?#105  100nF
C?#106  100nF
C?#107  100nF
C?#108  100nF
R?#48  100k
R?#49  100k
R?#50  100k
R?#51  100k
R?#52  100k
R?#53  100k
R?#54  100k
R?#55  100k
U?#11  LBEE59B1LV-278  (part A of 2)
U?#12  LBEE59B1LV-278  (part B of 2)

### Ports
WIRELESS (harness WIRELESS)

### Harnesses
WIRELESS: SDMMC3_D0, SDMMC3_D1, SDMMC3_D2, SDMMC3_D3, SDMMC3_CK, SDMMC3_CMD, BT_USART3_TX, BT_USART3_RX, BT_USART3_CTS, BT_USART3_RTS, BT_HOST_WAKE, WL_HOST_WAKE, BT_DEV_WAKE, WL_REG_ON, BT_REG_ON, BT_PCM_CLK, BT_PCM_SDI, BT_PCM_SDO, BT_PCM_WS, LPO_32

### Nets
GND: C?#100.1 C?#101.2 C?#102.2 C?#103.2 C?#104.2 C?#105.2 C?#106.2 C?#107.2 C?#108.2 U?#11.51(BT_RF_IN) U?#12.1(GND) U?#12.2(GND) U?#12.3(GND) U?#12.6(GND) U?#12.11(GND) U?#12.15(GND) U?#12.19(GND) U?#12.20(GND) U?#12.27(GND) U?#12.30(GND) U?#12.36(GND) U?#12.47(GND) U?#12.48(GND) U?#12.50(GND) U?#12.52(GND) U?#12.53(GND) U?#12.57(GND) U?#12.59(GND) U?#12.60(GND) U?#12.65(GND) U?#12.72(GND) U?#12.73(GND) U?#12.94(GND) U?#12.95(GND) U?#12.96(GND) U?#12.97(GND) U?#12.98(GND) U?#12.99(GND) U?#12.100(GND) U?#12.101(GND) U?#12.102(GND) U?#12.103(GND) U?#12.104(GND) U?#12.105(GND) U?#12.106(GND)
PMIC_LDO1_1V8: C?#105.1 C?#106.1 C?#107.1 C?#108.1 R?#50.1 R?#51.1 R?#52.1 R?#53.1 R?#54.1 R?#55.1 U?#11.13(VBAT) U?#11.14(VBAT) U?#11.35(VDDIO)
BT_DEV_WAKE: U?#11.29(BT_GPIO_0) ; port WIRELESS.BT_DEV_WAKE
BT_HOST_WAKE: U?#11.5(BT_HOST_WAKE) ; port WIRELESS.BT_HOST_WAKE
BT_PCM_CLK: U?#11.85(BT_PCM_CLK) ; port WIRELESS.BT_PCM_CLK
BT_PCM_SDI: U?#11.82(BT_PCM_OUT) ; port WIRELESS.BT_PCM_SDI
BT_PCM_SDO: U?#11.84(BT_PCM_IN) ; port WIRELESS.BT_PCM_SDO
BT_PCM_WS: U?#11.83(BT_PCM_SYNC) ; port WIRELESS.BT_PCM_WS
BT_REG_ON: U?#11.9(BT_REG_ON) ; port WIRELESS.BT_REG_ON
BT_USART3_CTS: U?#11.33(BT_UART_RTS) ; port WIRELESS.BT_USART3_CTS
BT_USART3_RTS: U?#11.34(BT_UART_CTS) ; port WIRELESS.BT_USART3_RTS  [project net BT_USART3_CTS]
BT_USART3_RX: U?#11.31(BT_UART_TXD) ; port WIRELESS.BT_USART3_RX
BT_USART3_TX: U?#11.32(BT_UART_RXD) ; port WIRELESS.BT_USART3_TX
LPO_32: U?#11.80(EXT_LPO) ; port WIRELESS.LPO_32
SDMMC3_CK: R?#52.2 U?#11.24(SDIO_CLK) ; port WIRELESS.SDMMC3_CK
SDMMC3_CMD: R?#50.2 U?#11.26(SDIO_CMD) ; port WIRELESS.SDMMC3_CMD
SDMMC3_D0: R?#53.2 U?#11.23(SDIO_DATA_0) ; port WIRELESS.SDMMC3_D0
SDMMC3_D1: R?#54.2 U?#11.22(SDIO_DATA_1) ; port WIRELESS.SDMMC3_D1
SDMMC3_D2: R?#55.2 U?#11.21(SDIO_DATA_2) ; port WIRELESS.SDMMC3_D2
SDMMC3_D3: R?#51.2 U?#11.25(SDIO_DATA_3) ; port WIRELESS.SDMMC3_D3
VDDOUT_VDDIO: C?#100.2 U?#11.4(VDDIO_SFL) U?#11.28(VDDOUT_VDDIO)
WL_HOST_WAKE: U?#11.7(WL_HOST_WAKE) ; port WIRELESS.WL_HOST_WAKE
WL_REG_ON: U?#11.10(WL_REG_ON) ; port WIRELESS.WL_REG_ON
NetC?#101_1: C?#101.1 R?#48.1 U?#11.49(BT_RF_OUT)
NetC?#102_1: C?#102.1 R?#48.2
NetC?#103_1: C?#103.1 R?#49.1 U?#11.58(ANT0)
NetC?#104_1: C?#104.1 R?#49.2

Not connected (* = marked no-connect by the designer): U?#11 8(WL_GPIO_1)* 12(VOUT_3P3)* 16(RF_SW_CTRL_8)* 17(RF_SW_CTRL_12)* 18(RF_SW_CTRL_11)* 37(P9)* 38(P11)* 39(P13)* 40(P5)* 41(P6)* 42(P8)* 43(P7)* 44(P12)* 45(P0)* 46(P1)* 54(RF_SW_CTRL_6)* 55(RF_SW_CTRL_10)* 56(RF_SW_CTRL_5)* 61(WL_GPIO_15)* 62(WL_GPIO_13)* 63(WL_GPIO_12)* 64(WL_GPIO_14)* 66(WL_GPIO_5)* 67(WL_GPIO_4)* 68(WL_GPIO_3)* 69(WL_GPIO_2)* 70(NC)* 71(WL_GPIO_6)* 74(SFL_IO0)* 75(SFL_IO3)* 76(SFL_IO2)* 77(SFL_CLK)* 78(SFL_IO1)* 79(SFL_CS)* 81(CLK_REQ)* 86(BT_I2S_WS)* 87(BT_I2S_CLK)* 88(BT_I2S_DI)* 89(BT_I2S_DO)* 90(BT_GPIO_2)* 91(BT_GPIO_5)* 92(BT_GPIO_4)* 93(BT_GPIO_3)*

### Notes on the sheet
- Title
- Size:
- Date:
- A4
- Revision:
- Sheet:
- Project Name:
- of
- Drawn By:
- Checked By:

### Library data of the parts
C?#100-C?#108 = CAP_SMD: as C?#1 on sheet MPU Power; Supplier 1: Mouser; Manufacturer 1: *; Manufacturer Part Number 1: *; RoHS: Yes; Mount: Surface Mount; Package: *; Capacitance: *; Length: *; Lead Free: Lead Free; Supplier Part Number 1: *; Supplier 2: Digikey; Supplier Part Number 2: *; Value: 100nF
R?#48-R?#55 = RES_SMD: General Purpose Chip Resistor Thick Film; Supplier 1: Mouser; RoHS: Yes; Category: Resistors; RoHS Compliant: Yes; Resistance: *; Supplier 2: Digikey; Supplier Part Number 2: *; Package: *; Value: 100k
U?#11 U?#12 = LBEE59B1LV-278: Module Wi-Fi 11a/b/g/n + Bluetooth 5.0, 3.2V to 4.4V 106-Pin LGA T/R; Manufacturer 1: Murata; Supplier 1: Mouser; Manufacturer Part Number 1: LBEE59B1LV-278; RoHS: No; Category: RF Receivers, Transceivers; Supplier 2: Digi-Key; Datasheet: https://wireless.murata.com/pub/RFM/data/type1lv.pdf; Supplier Part Number 2: 490-18384-1-ND; Supplier Part Number 1: 81-LBEE59B1LV-278